# Altium project 003-00004.PrjPcb (part 1 of 2)
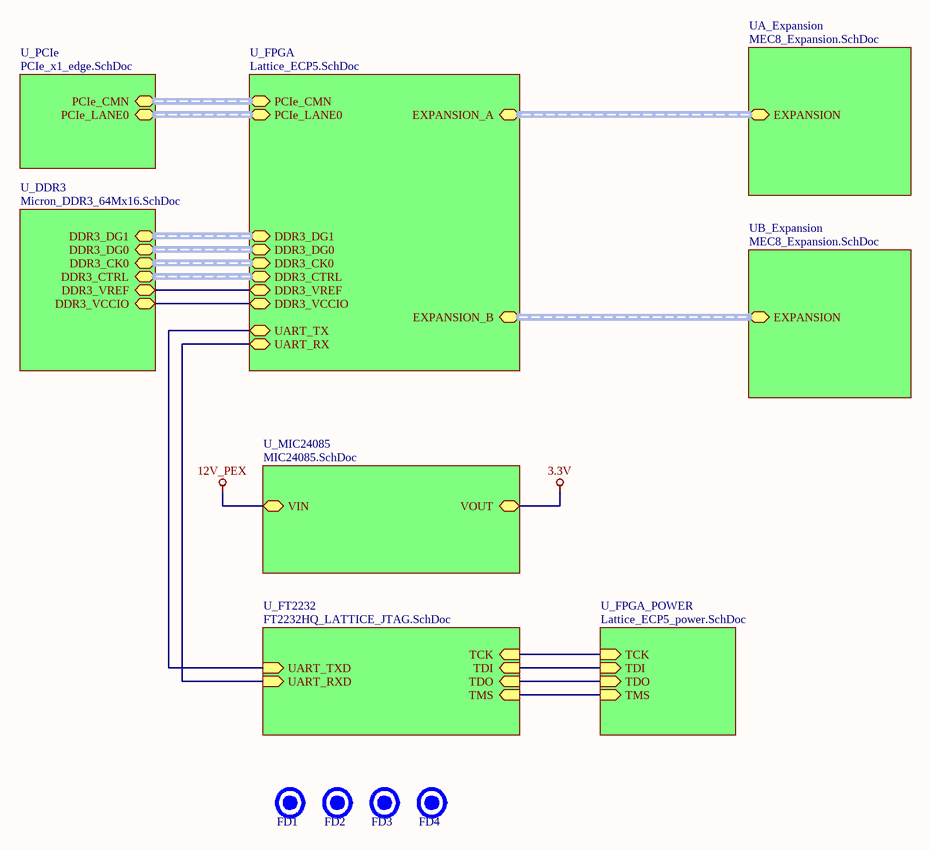
[diagram p0: 003-00004.SchDoc]
copyrightDate: 2014; DrillDrawingRevision: B; PCBPartNumber: 003-00004
8 sheets, 215 parts. Net scope: hierarchical (ports join the sheet entries above them; power ports are global).
Board file: 003-00004.PcbDoc
Sheets:
  003-00004.SchDoc
    U_FPGA = Lattice_ECP5.SchDoc
    U_FPGA_POWER = Lattice_ECP5_power.SchDoc
    UA_Expansion = MEC8_Expansion.SchDoc
    U_PCIe = PCIe_x1_edge.SchDoc
    UB_Expansion = MEC8_Expansion.SchDoc
    U_MIC24085 = MIC24085.SchDoc
    U_FT2232 = FT2232HQ_LATTICE_JTAG.SchDoc
    U_DDR3 = Micron_DDR3_64Mx16.SchDoc

## Sheet 003-00004.SchDoc: <title>
size C; Organization: Custom Embedded Solutions, LLC.; Address1: 130 Oakland Trace; Address2: Madison, AL 35758; DocumentNumber: <doc_num>; Revision: <Rev>; SheetNumber: 1; SheetTotal: 8; PageTitle: Block Diagram

### Parts
FD1  (no value)  [005-00024]  (no BOM)
FD2  (no value)  [005-00024]  (no BOM)
FD3  (no value)  [005-00024]  (no BOM)
FD4  (no value)  [005-00024]  (no BOM)

### Sub-sheets
U_DDR3 = Micron_DDR3_64Mx16.SchDoc: DDR3_DG1 (harness DDR3_DATAGRP), DDR3_DG0 (harness DDR3_DATAGRP), DDR3_CK0 (harness DDR3_CLK), DDR3_CTRL (harness DDR3_CTRL), DDR3_VREF, DDR3_VCCIO
U_FPGA = Lattice_ECP5.SchDoc: PCIe_CMN (harness PCIe_COMMON), PCIe_LANE0 (harness PCIe_LANE), EXPANSION_A (harness GPIO_EXPANSION), EXPANSION_B (harness GPIO_EXPANSION), DDR3_DG1 (harness DDR3_DATAGRP), DDR3_DG0 (harness DDR3_DATAGRP), DDR3_CK0 (harness DDR3_CLK), DDR3_CTRL (harness DDR3_CTRL), DDR3_VREF, DDR3_VCCIO, UART_TX, UART_RX
U_FPGA_POWER = Lattice_ECP5_power.SchDoc: TCK (in), TDI (in), TDO (in), TMS (in)
U_FT2232 = FT2232HQ_LATTICE_JTAG.SchDoc: TCK (in), TDI (in), TDO (in), TMS (in), UART_TXD (in), UART_RXD (in)
U_MIC24085 = MIC24085.SchDoc: VIN, VOUT
U_PCIe = PCIe_x1_edge.SchDoc: PCIe_CMN (harness PCIe_COMMON), PCIe_LANE0 (harness PCIe_LANE)
UA_Expansion = MEC8_Expansion.SchDoc: EXPANSION (harness GPIO_EXPANSION)
UB_Expansion = MEC8_Expansion.SchDoc: EXPANSION (harness GPIO_EXPANSION)

### Nets
DDR3_VCC: sheet U_FPGA/DDR3_VCCIO, sheet U_DDR3/DDR3_VCCIO
DDR3_VREF: sheet U_FPGA/DDR3_VREF, sheet U_DDR3/DDR3_VREF
JTAG_TCK: sheet U_FPGA_POWER/TCK, sheet U_FT2232/TCK
JTAG_TDI: sheet U_FPGA_POWER/TDI, sheet U_FT2232/TDI
JTAG_TDO: sheet U_FPGA_POWER/TDO, sheet U_FT2232/TDO
JTAG_TMS: sheet U_FPGA_POWER/TMS, sheet U_FT2232/TMS
TOP8: sheet U_FPGA/UART_TX, sheet U_FT2232/UART_TXD
TOP18: sheet U_FPGA/UART_RX, sheet U_FT2232/UART_RXD

### Buses and harness runs
harness sheet U_DDR3/DDR3_CK0 = sheet U_FPGA/DDR3_CK0
harness sheet U_DDR3/DDR3_CTRL = sheet U_FPGA/DDR3_CTRL
harness sheet U_DDR3/DDR3_DG0 = sheet U_FPGA/DDR3_DG0
harness sheet U_DDR3/DDR3_DG1 = sheet U_FPGA/DDR3_DG1
harness sheet U_FPGA/EXPANSION_A = sheet UA_Expansion/EXPANSION
harness sheet U_FPGA/EXPANSION_B = sheet UB_Expansion/EXPANSION
harness sheet U_FPGA/PCIe_CMN = sheet U_PCIe/PCIe_CMN
harness sheet U_FPGA/PCIe_LANE0 = sheet U_PCIe/PCIe_LANE0

### Notes on the sheet
- Copyright (c)
- Page Title
- Design Title
- Creative Commons License, http://creativecommons.org/licenses/by/4.0/legalcode
  This PCB design by Custom Embedded Solutions, LLC. is licensed under a Creative Commons Attribution 4.0 International License.
- Size:
- Date:
- File:
- C
- Document Number:
- Time:
- Sheet
- Rev:
- of

### Library data of the parts
FD1-FD4 = 008-00008: PCB fiducial, IPC-7351; Part Number: 008-00008; Package: Edge Connector, MEC8-30

## Sheet Lattice_ECP5.SchDoc: <title>
size C; Organization: Custom Embedded Solutions, LLC.; Address1: 130 Oakland Trace; Address2: Madison, AL 35758; DocumentNumber: <doc_num>; Revision: <Rev>; SheetNumber: 2; SheetTotal: 8; PageTitle: FPGA I/O
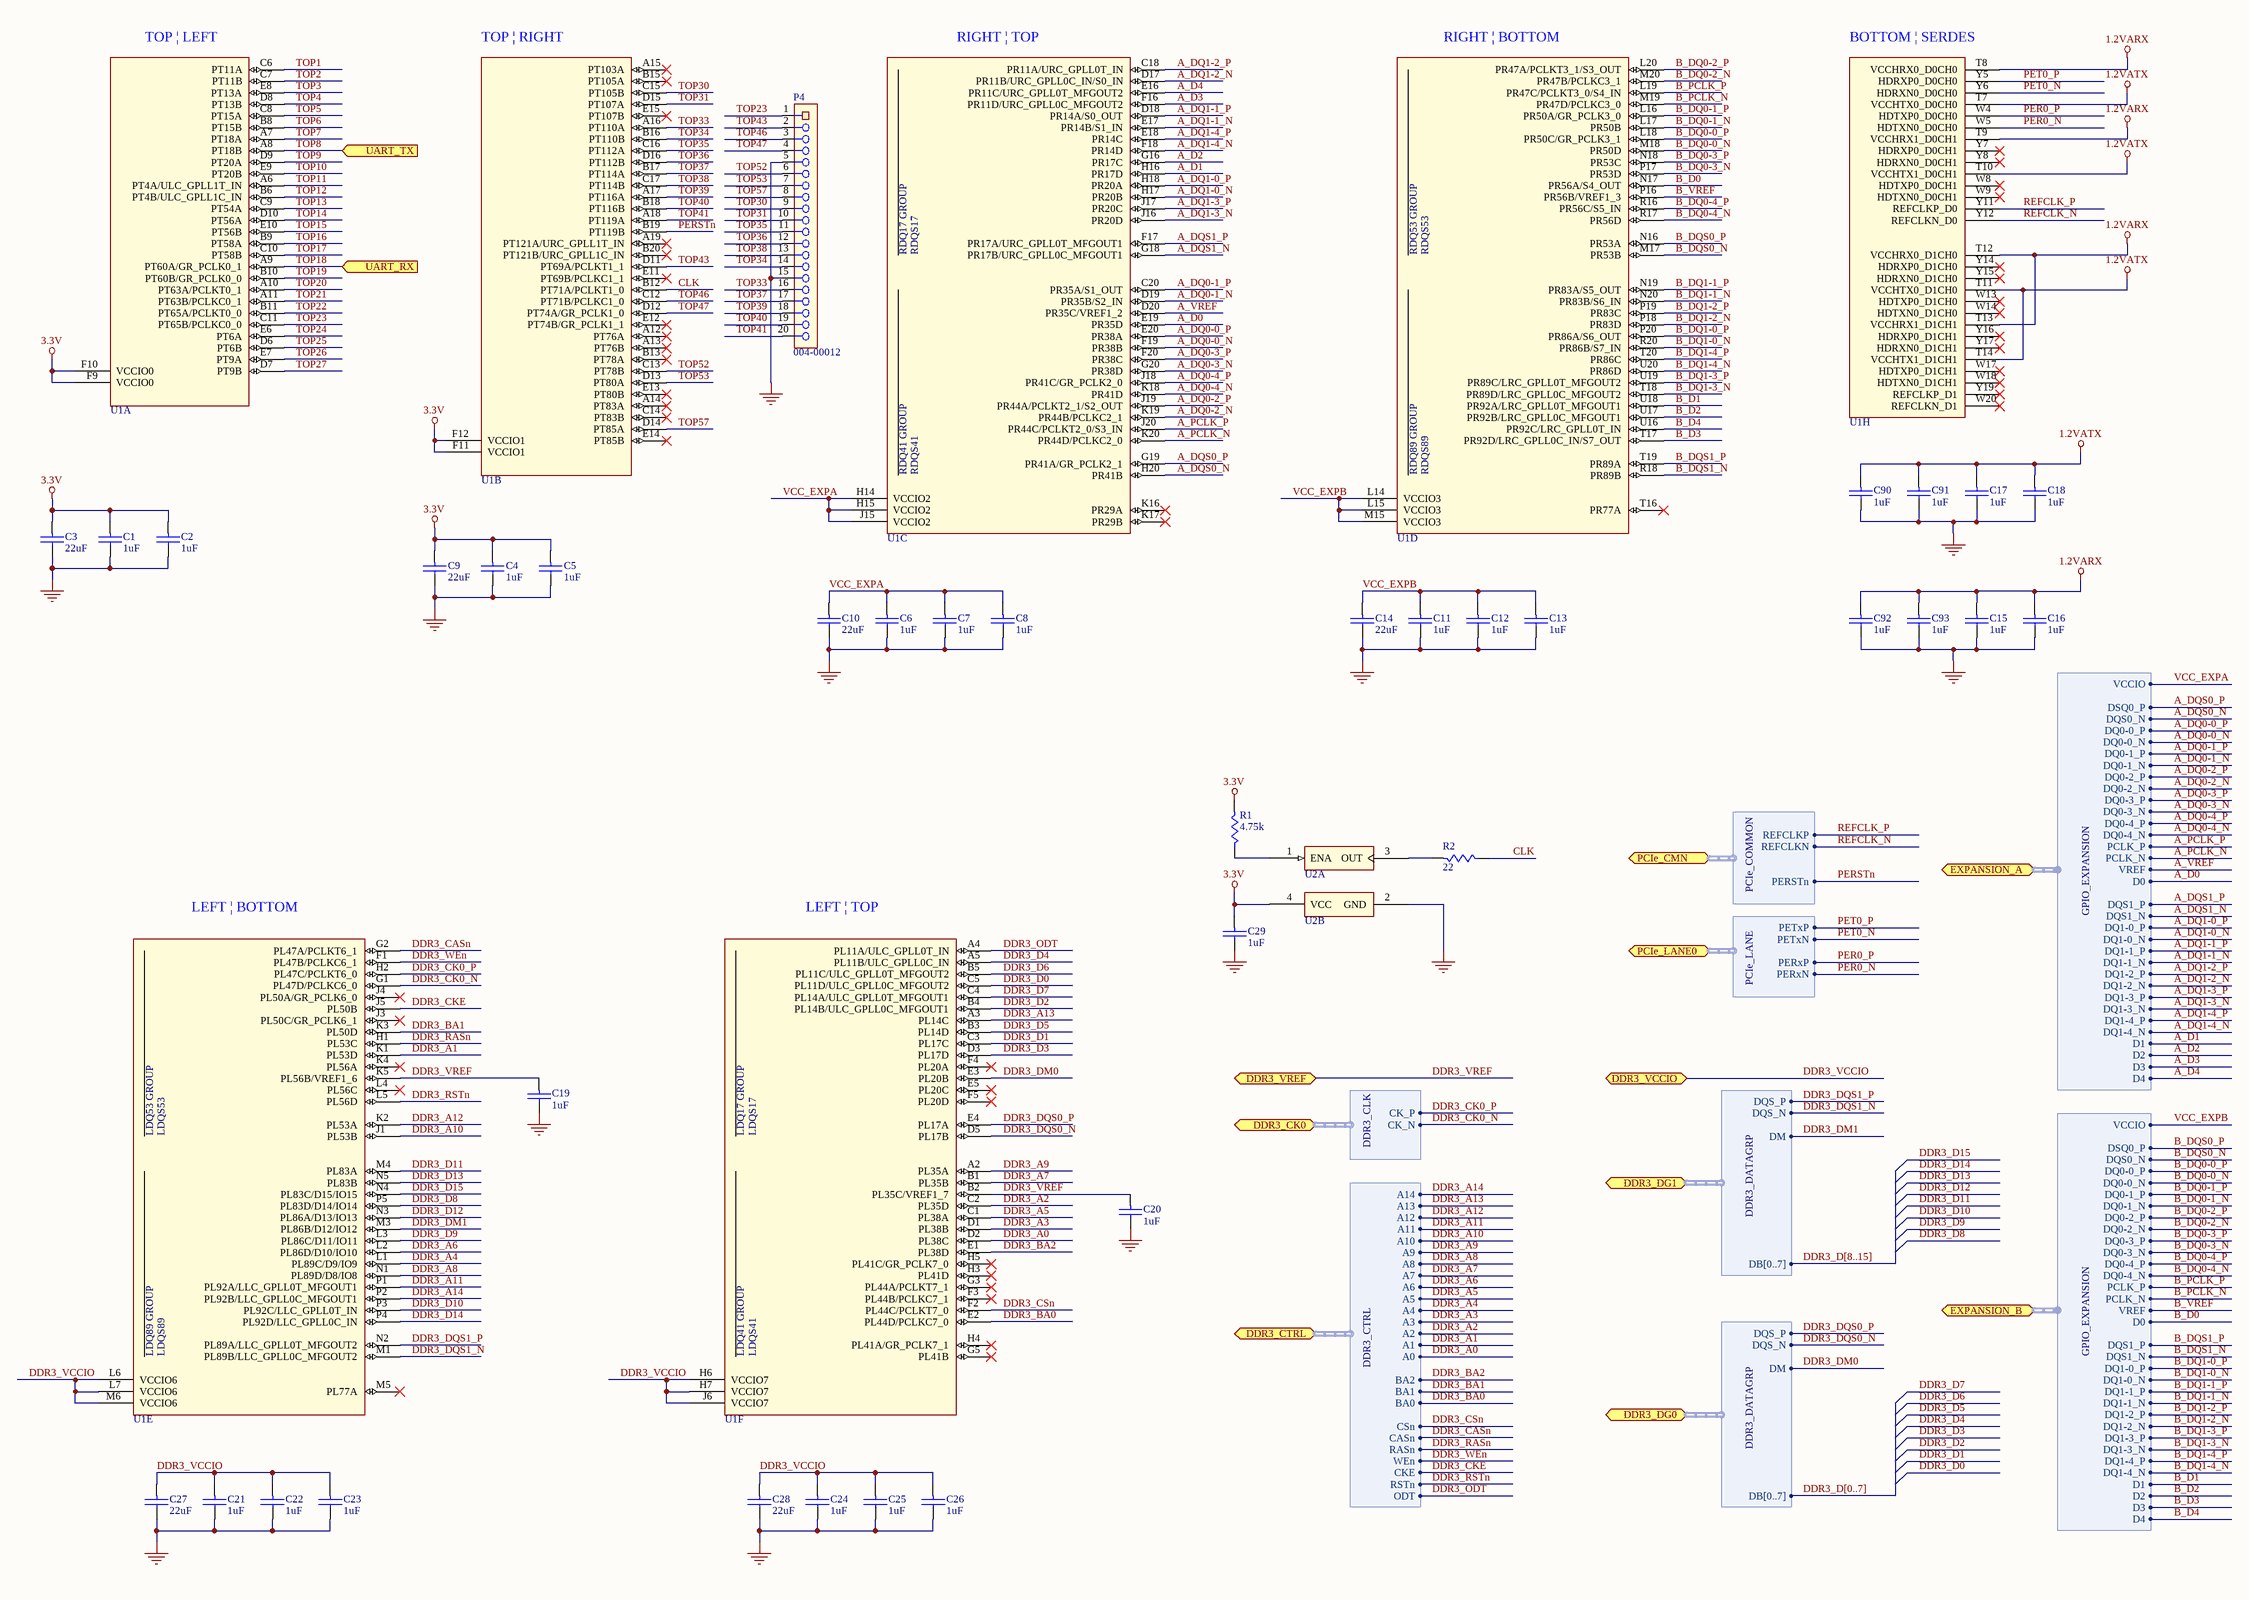
[diagram p1: Lattice_ECP5.SchDoc]

### Parts
(Parts that share a designator on the sheet are numbered #1, #2 ... from top to bottom, then left to right.)
C1#1  1uF  [005-00008]
C2#1  1uF  [005-00008]
C3#1  22uF  [005-00003]
C4#1  1uF  [005-00008]
C5#1  1uF  [005-00008]
C6#1  1uF  [005-00008]
C7#1  1uF  [005-00008]
C8#1  1uF  [005-00008]
C9#1  22uF  [005-00003]
C10#1  22uF  [005-00003]
C11  1uF  [005-00008]
C12  1uF  [005-00008]
C13  1uF  [005-00008]
C14  22uF  [005-00003]
C15  1uF  [005-00008]
C16  1uF  [005-00008]
C17  1uF  [005-00008]
C18  1uF  [005-00008]
C19  1uF  [005-00008]
C20  1uF  [005-00008]
C21  1uF  [005-00008]
C22  1uF  [005-00008]
C23  1uF  [005-00008]
C24  1uF  [005-00008]
C25  1uF  [005-00008]
C26  1uF  [005-00008]
C27  22uF  [005-00003]
C28  22uF  [005-00003]
C29  1uF  [005-00008]
C90  1uF  [005-00008]
C91  1uF  [005-00008]
C92  1uF  [005-00008]
C93  1uF  [005-00008]
P4  004-00012  [005-00014]
R1  4.75k  [005-00009]
R2#1  22  [005-00009]
U1#1  004-00015  [005-00017]  (value not drawn)  (parts A,B,C,D,E,F,H of 10)
U2#1  004-00014  [005-00016]  (value not drawn)  (parts A,B of 2)

### Ports
DDR3_CK0 (harness DDR3_CLK), DDR3_CTRL (harness DDR3_CTRL), DDR3_DG0 (harness DDR3_DATAGRP), DDR3_DG1 (harness DDR3_DATAGRP), DDR3_VCCIO, DDR3_VREF, EXPANSION_A (harness GPIO_EXPANSION), EXPANSION_B (harness GPIO_EXPANSION), PCIe_CMN (harness PCIe_COMMON), PCIe_LANE0 (harness PCIe_LANE), UART_RX (in), UART_TX (in)

### Harnesses
PCIe_COMMON: PERSTn, REFCLKP, REFCLKN
PCIe_LANE: PETxP, PETxN, PERxP, PERxN
GPIO_EXPANSION: DSQ0_P, DQS0_N, DQ0-0_P, DQ0-0_N, DQ0-1_P, DQ0-1_N, DQ0-2_P, DQ0-2_N, DQ0-3_P, DQ0-3_N, DQ0-4_P, DQ0-4_N, PCLK_P, PCLK_N, VREF, D0, DQS1_P, DQS1_N, DQ1-0_P, DQ1-0_N, DQ1-1_P, DQ1-1_N, DQ1-2_P, DQ1-2_N, DQ1-3_P, DQ1-3_N, DQ1-4_P, DQ1-4_N, D1, D2, D3, D4, VCCIO
DDR3_CLK: CK_P, CK_N
DDR3_CTRL: A14, A13, A12, A11, A10, A9, A8, A7, A6, A5, A4, A3, A2, A1, A0, BA2, BA1, BA0, CSn, RASn, CASn, WEn, CKE, RSTn, ODT
DDR3_DATAGRP: DQS_P, DQS_N, DM, DB[0..7]

### Nets
1.2VARX: C15.1 C16.1 C92.1 C93.1 U1#1.T8(VCCHRX0_D0CH0) U1#1.T9(VCCHRX1_D0CH1) U1#1.T12(VCCHRX0_D1CH0) U1#1.T13(VCCHRX1_D1CH1)
1.2VATX: C17.1 C18.1 C90.1 C91.1 U1#1.T7(VCCHTX0_D0CH0) U1#1.T10(VCCHTX1_D0CH1) U1#1.T11(VCCHTX0_D1CH0) U1#1.T14(VCCHTX1_D1CH1)
3.3V: C1#1.1 C2#1.1 C3#1.1 C4#1.1 C5#1.1 C9#1.1 C29.1 R1.1 U1#1.F9(VCCIO0) U1#1.F10(VCCIO0) U1#1.F11(VCCIO1) U1#1.F12(VCCIO1) U2#1.4(VCC)
GND: C1#1.2 C2#1.2 C3#1.2 C4#1.2 C5#1.2 C6#1.2 C7#1.2 C8#1.2 C9#1.2 C10#1.2 C11.2 C12.2 C13.2 C14.2 C15.2 C16.2 C17.2 C18.2 C19.2 C20.2 C21.2 C22.2 C23.2 C24.2 C25.2 C26.2 C27.2 C28.2 C29.2 C90.2 C91.2 C92.2 C93.2 P4.5 P4.15 U2#1.2(GND)
A_D0: U1#1.E19(PR35D) ; port EXPANSION_A.D0
A_D1: U1#1.H16(PR17D) ; port EXPANSION_A.D1
A_D2: U1#1.G16(PR17C) ; port EXPANSION_A.D2
A_D3: U1#1.F16(PR11D/URC_GPLL0C_MFGOUT2) ; port EXPANSION_A.D3
A_D4: U1#1.E16(PR11C/URC_GPLL0T_MFGOUT2) ; port EXPANSION_A.D4
A_DQ0-0_N: U1#1.F19(PR38B) ; port EXPANSION_A.DQ0-0_N
A_DQ0-0_P: U1#1.E20(PR38A) ; port EXPANSION_A.DQ0-0_P
A_DQ0-1_N: U1#1.D19(PR35B/S2_IN) ; port EXPANSION_A.DQ0-1_N
A_DQ0-1_P: U1#1.C20(PR35A/S1_OUT) ; port EXPANSION_A.DQ0-1_P
A_DQ0-2_N: U1#1.K19(PR44B/PCLKC2_1) ; port EXPANSION_A.DQ0-2_N
A_DQ0-2_P: U1#1.J19(PR44A/PCLKT2_1/S2_OUT) ; port EXPANSION_A.DQ0-2_P
A_DQ0-3_N: U1#1.G20(PR38D) ; port EXPANSION_A.DQ0-3_N
A_DQ0-3_P: U1#1.F20(PR38C) ; port EXPANSION_A.DQ0-3_P
A_DQ0-4_N: U1#1.K18(PR41D) ; port EXPANSION_A.DQ0-4_N
A_DQ0-4_P: U1#1.J18(PR41C/GR_PCLK2_0) ; port EXPANSION_A.DQ0-4_P
A_DQ1-0_N: U1#1.H17(PR20B) ; port EXPANSION_A.DQ1-0_N
A_DQ1-0_P: U1#1.H18(PR20A) ; port EXPANSION_A.DQ1-0_P
A_DQ1-1_N: U1#1.E17(PR14B/S1_IN) ; port EXPANSION_A.DQ1-1_N
A_DQ1-1_P: U1#1.D18(PR14A/S0_OUT) ; port EXPANSION_A.DQ1-1_P
A_DQ1-2_N: U1#1.D17(PR11B/URC_GPLL0C_IN/S0_IN) ; port EXPANSION_A.DQ1-2_N
A_DQ1-2_P: U1#1.C18(PR11A/URC_GPLL0T_IN) ; port EXPANSION_A.DQ1-2_P
A_DQ1-3_N: U1#1.J16(PR20D) ; port EXPANSION_A.DQ1-3_N
A_DQ1-3_P: U1#1.J17(PR20C) ; port EXPANSION_A.DQ1-3_P
A_DQ1-4_N: U1#1.F18(PR14D) ; port EXPANSION_A.DQ1-4_N
A_DQ1-4_P: U1#1.E18(PR14C) ; port EXPANSION_A.DQ1-4_P
A_DQS0_N: U1#1.H20(PR41B) ; port EXPANSION_A.DQS0_N
A_DQS0_P: U1#1.G19(PR41A/GR_PCLK2_1) ; port EXPANSION_A.DSQ0_P
A_DQS1_N: U1#1.G18(PR17B/URC_GPLL0C_MFGOUT1) ; port EXPANSION_A.DQS1_N
A_DQS1_P: U1#1.F17(PR17A/URC_GPLL0T_MFGOUT1) ; port EXPANSION_A.DQS1_P
A_PCLK_N: U1#1.K20(PR44D/PCLKC2_0) ; port EXPANSION_A.PCLK_N
A_PCLK_P: U1#1.J20(PR44C/PCLKT2_0/S3_IN) ; port EXPANSION_A.PCLK_P
A_VREF: U1#1.D20(PR35C/VREF1_2) ; port EXPANSION_A.VREF
B_D0: U1#1.N17(PR56A/S4_OUT) ; port EXPANSION_B.D0
B_D1: U1#1.U18(PR92A/LRC_GPLL0T_MFGOUT1) ; port EXPANSION_B.D1
B_D2: U1#1.U17(PR92B/LRC_GPLL0C_MFGOUT1) ; port EXPANSION_B.D2
B_D3: U1#1.T17(PR92D/LRC_GPLL0C_IN/S7_OUT) ; port EXPANSION_B.D3
B_D4: U1#1.U16(PR92C/LRC_GPLL0T_IN) ; port EXPANSION_B.D4
B_DQ0-0_N: U1#1.M18(PR50D) ; port EXPANSION_B.DQ0-0_N
B_DQ0-0_P: U1#1.L18(PR50C/GR_PCLK3_1) ; port EXPANSION_B.DQ0-0_P
B_DQ0-1_N: U1#1.L17(PR50B) ; port EXPANSION_B.DQ0-1_N
B_DQ0-1_P: U1#1.L16(PR50A/GR_PCLK3_0) ; port EXPANSION_B.DQ0-1_P
B_DQ0-2_N: U1#1.M20(PR47B/PCLKC3_1) ; port EXPANSION_B.DQ0-2_N
B_DQ0-2_P: U1#1.L20(PR47A/PCLKT3_1/S3_OUT) ; port EXPANSION_B.DQ0-2_P
B_DQ0-3_N: U1#1.P17(PR53D) ; port EXPANSION_B.DQ0-3_N
B_DQ0-3_P: U1#1.N18(PR53C) ; port EXPANSION_B.DQ0-3_P
B_DQ0-4_N: U1#1.R17(PR56D) ; port EXPANSION_B.DQ0-4_N
B_DQ0-4_P: U1#1.R16(PR56C/S5_IN) ; port EXPANSION_B.DQ0-4_P
B_DQ1-0_N: U1#1.R20(PR86B/S7_IN) ; port EXPANSION_B.DQ1-0_N
B_DQ1-0_P: U1#1.P20(PR86A/S6_OUT) ; port EXPANSION_B.DQ1-0_P
B_DQ1-1_N: U1#1.N20(PR83B/S6_IN) ; port EXPANSION_B.DQ1-1_N
B_DQ1-1_P: U1#1.N19(PR83A/S5_OUT) ; port EXPANSION_B.DQ1-1_P
B_DQ1-2_N: U1#1.P18(PR83D) ; port EXPANSION_B.DQ1-2_N
B_DQ1-2_P: U1#1.P19(PR83C) ; port EXPANSION_B.DQ1-2_P
B_DQ1-3_N: U1#1.T18(PR89D/LRC_GPLL0C_MFGOUT2) ; port EXPANSION_B.DQ1-3_N
B_DQ1-3_P: U1#1.U19(PR89C/LRC_GPLL0T_MFGOUT2) ; port EXPANSION_B.DQ1-3_P
B_DQ1-4_N: U1#1.U20(PR86D) ; port EXPANSION_B.DQ1-4_N
B_DQ1-4_P: U1#1.T20(PR86C) ; port EXPANSION_B.DQ1-4_P
B_DQS0_N: U1#1.M17(PR53B) ; port EXPANSION_B.DQS0_N
B_DQS0_P: U1#1.N16(PR53A) ; port EXPANSION_B.DSQ0_P
B_DQS1_N: U1#1.R18(PR89B) ; port EXPANSION_B.DQS1_N
B_DQS1_P: U1#1.T19(PR89A) ; port EXPANSION_B.DQS1_P
B_PCLK_N: U1#1.M19(PR47D/PCLKC3_0) ; port EXPANSION_B.PCLK_N
B_PCLK_P: U1#1.L19(PR47C/PCLKT3_0/S4_IN) ; port EXPANSION_B.PCLK_P
B_VREF: U1#1.P16(PR56B/VREF1_3) ; port EXPANSION_B.VREF
CLK: R2#1.2 U1#1.B12(PT71A/PCLKT1_0)
DDR3_A0: U1#1.D2(PL38C) ; port DDR3_CTRL.A0
DDR3_A1: U1#1.K1(PL53D) ; port DDR3_CTRL.A1
DDR3_A2: U1#1.C2(PL35D) ; port DDR3_CTRL.A2
DDR3_A3: U1#1.D1(PL38B) ; port DDR3_CTRL.A3
DDR3_A4: U1#1.L1(PL89C/D9/IO9) ; port DDR3_CTRL.A4
DDR3_A5: U1#1.C1(PL38A) ; port DDR3_CTRL.A5
DDR3_A6: U1#1.L2(PL86D/D10/IO10) ; port DDR3_CTRL.A6
DDR3_A7: U1#1.B1(PL35B) ; port DDR3_CTRL.A7
DDR3_A8: U1#1.N1(PL89D/D8/IO8) ; port DDR3_CTRL.A8
DDR3_A9: U1#1.A2(PL35A) ; port DDR3_CTRL.A9
DDR3_A10: U1#1.J1(PL53B) ; port DDR3_CTRL.A10
DDR3_A11: U1#1.P1(PL92A/LLC_GPLL0T_MFGOUT1) ; port DDR3_CTRL.A11
DDR3_A12: U1#1.K2(PL53A) ; port DDR3_CTRL.A12
DDR3_A13: U1#1.A3(PL14C) ; port DDR3_CTRL.A13
DDR3_A14: U1#1.P2(PL92B/LLC_GPLL0C_MFGOUT1) ; port DDR3_CTRL.A14
DDR3_BA0: U1#1.E2(PL44D/PCLKC7_0) ; port DDR3_CTRL.BA0
DDR3_BA1: U1#1.K3(PL50D) ; port DDR3_CTRL.BA1
DDR3_BA2: U1#1.E1(PL38D) ; port DDR3_CTRL.BA2
DDR3_CASn: U1#1.G2(PL47A/PCLKT6_1) ; port DDR3_CTRL.CASn
DDR3_CK0_N: U1#1.G1(PL47D/PCLKC6_0) ; port DDR3_CK0.CK_N
DDR3_CK0_P: U1#1.H2(PL47C/PCLKT6_0) ; port DDR3_CK0.CK_P
DDR3_CKE: U1#1.J5(PL50B) ; port DDR3_CTRL.CKE
DDR3_CSn: U1#1.F2(PL44C/PCLKT7_0) ; port DDR3_CTRL.CSn
DDR3_D0: U1#1.C5(PL11D/ULC_GPLL0C_MFGOUT2)
DDR3_D1: U1#1.C3(PL17C)
DDR3_D2: U1#1.B4(PL14B/ULC_GPLL0C_MFGOUT1)
DDR3_D3: U1#1.D3(PL17D)
DDR3_D4: U1#1.A5(PL11B/ULC_GPLL0C_IN)
DDR3_D5: U1#1.B3(PL14D)
DDR3_D6: U1#1.B5(PL11C/ULC_GPLL0T_MFGOUT2)
DDR3_D7: U1#1.C4(PL14A/ULC_GPLL0T_MFGOUT1)
DDR3_D8: U1#1.P5(PL83D/D14/IO14)
DDR3_D9: U1#1.L3(PL86C/D11/IO11)
DDR3_D10: U1#1.P3(PL92C/LLC_GPLL0T_IN)
DDR3_D11: U1#1.M4(PL83A)
DDR3_D12: U1#1.N3(PL86A/D13/IO13)
DDR3_D13: U1#1.N5(PL83B)
DDR3_D14: U1#1.P4(PL92D/LLC_GPLL0C_IN)
DDR3_D15: U1#1.N4(PL83C/D15/IO15)
DDR3_DM0: U1#1.E3(PL20B) ; port DDR3_DG0.DM
DDR3_DM1: U1#1.M3(PL86B/D12/IO12) ; port DDR3_DG1.DM
DDR3_DQS0_N: U1#1.D5(PL17B) ; port DDR3_DG0.DQS_N
DDR3_DQS0_P: U1#1.E4(PL17A) ; port DDR3_DG0.DQS_P
DDR3_DQS1_N: U1#1.M1(PL89B/LLC_GPLL0C_MFGOUT2) ; port DDR3_DG1.DQS_N
DDR3_DQS1_P: U1#1.N2(PL89A/LLC_GPLL0T_MFGOUT2) ; port DDR3_DG1.DQS_P
DDR3_ODT: U1#1.A4(PL11A/ULC_GPLL0T_IN) ; port DDR3_CTRL.ODT
DDR3_RASn: U1#1.H1(PL53C) ; port DDR3_CTRL.RASn
DDR3_RSTn: U1#1.L5(PL56D) ; port DDR3_CTRL.RSTn
DDR3_VCCIO: C21.1 C22.1 C23.1 C24.1 C25.1 C26.1 C27.1 C28.1 U1#1.H6(VCCIO7) U1#1.H7(VCCIO7) U1#1.J6(VCCIO7) U1#1.L6(VCCIO6) U1#1.L7(VCCIO6) U1#1.M6(VCCIO6) ; port DDR3_VCCIO  [project net DDR3_VCC]
DDR3_VREF: C19.1 C20.1 U1#1.B2(PL35C/VREF1_7) U1#1.K5(PL56B/VREF1_6) ; port DDR3_VREF
DDR3_WEn: U1#1.F1(PL47B/PCLKC6_1) ; port DDR3_CTRL.WEn
PER0_N: U1#1.W5(HDTXN0_D0CH0) ; port PCIe_LANE0.PERxN
PER0_P: U1#1.W4(HDTXP0_D0CH0) ; port PCIe_LANE0.PERxP
PERSTn: U1#1.B19(PT119B) ; port PCIe_CMN.PERSTn
PET0_N: U1#1.Y6(HDRXN0_D0CH0) ; port PCIe_LANE0.PETxN
PET0_P: U1#1.Y5(HDRXP0_D0CH0) ; port PCIe_LANE0.PETxP
REFCLK_N: U1#1.Y12(REFCLKN_D0) ; port PCIe_CMN.REFCLKN
REFCLK_P: U1#1.Y11(REFCLKP_D0) ; port PCIe_CMN.REFCLKP
TOP1: U1#1.C6(PT11A)
TOP2: U1#1.C7(PT11B)
TOP3: U1#1.E8(PT13A)
TOP4: U1#1.D8(PT13B)
TOP5: U1#1.C8(PT15A)
TOP6: U1#1.B8(PT15B)
TOP7: U1#1.A7(PT18A)
TOP8: U1#1.A8(PT18B) ; port UART_TX
TOP9: U1#1.D9(PT20A)
TOP10: U1#1.E9(PT20B)
TOP11: U1#1.A6(PT4A/ULC_GPLL1T_IN)
TOP12: U1#1.B6(PT4B/ULC_GPLL1C_IN)
TOP13: U1#1.C9(PT54A)
TOP14: U1#1.D10(PT56A)
TOP15: U1#1.E10(PT56B)
TOP16: U1#1.B9(PT58A)
TOP17: U1#1.C10(PT58B)
TOP18: U1#1.A9(PT60A/GR_PCLK0_1) ; port UART_RX
TOP19: U1#1.B10(PT60B/GR_PCLK0_0)
TOP20: U1#1.A10(PT63A/PCLKT0_1)
TOP21: U1#1.A11(PT63B/PCLKC0_1)
TOP22: U1#1.B11(PT65A/PCLKT0_0)
TOP23: P4.1 U1#1.C11(PT65B/PCLKC0_0)
TOP24: U1#1.E6(PT6A)
TOP25: U1#1.D6(PT6B)
TOP26: U1#1.E7(PT9A)
TOP27: U1#1.D7(PT9B)
TOP30: P4.9 U1#1.C15(PT105B)
TOP31: P4.10 U1#1.D15(PT107A)
TOP33: P4.16 U1#1.A16(PT110A)
TOP34: P4.14 U1#1.B16(PT110B)
TOP35: P4.11 U1#1.C16(PT112A)
TOP36: P4.12 U1#1.D16(PT112B)
TOP37: P4.17 U1#1.B17(PT114A)
TOP38: P4.13 U1#1.C17(PT114B)
TOP39: P4.18 U1#1.A17(PT116A)
TOP40: P4.19 U1#1.B18(PT116B)
TOP41: P4.20 U1#1.A18(PT119A)
TOP43: P4.2 U1#1.D11(PT69A/PCLKT1_1)
TOP46: P4.3 U1#1.C12(PT71B/PCLKC1_0)
TOP47: P4.4 U1#1.D12(PT74A/GR_PCLK1_0)
TOP52: P4.6 U1#1.C13(PT78B)
TOP53: P4.7 U1#1.D13(PT80A)
TOP57: P4.8 U1#1.D14(PT85A)
VCC_EXPA: C6#1.1 C7#1.1 C8#1.1 C10#1.1 U1#1.H14(VCCIO2) U1#1.H15(VCCIO2) U1#1.J15(VCCIO2) ; port EXPANSION_A.VCCIO
VCC_EXPB: C11.1 C12.1 C13.1 C14.1 U1#1.L14(VCCIO3) U1#1.L15(VCCIO3) U1#1.M15(VCCIO3) ; port EXPANSION_B.VCCIO
NetR1_2: R1.2 U2#1.1(ENA)
NetR2#1_1: R2#1.1 U2#1.3(OUT)

Not connected (* = marked no-connect by the designer): U1#1 A12(PT76A)* A13(PT76B)* A14(PT83A)* A15(PT103A)* A19(PT121A/URC_GPLL1T_IN)* B13(PT78A)* B15(PT105A)* B20(PT121B/URC_GPLL1C_IN)* C14(PT83B)* E5(PL20C)* E11(PT69B/PCLKC1_1)* E12(PT74B/GR_PCLK1_1)* E13(PT80B)* E14(PT85B)* E15(PT107B)* F3(PL44B/PCLKC7_1)* F4(PL20A)* F5(PL20D)* G3(PL44A/PCLKT7_1)* G5(PL41B)* H3(PL41D)* H4(PL41A/GR_PCLK7_1)* H5(PL41C/GR_PCLK7_0)* J3(PL50C/GR_PCLK6_1)* J4(PL50A/GR_PCLK6_0)* K4(PL56A)* K16(PR29A)* K17(PR29B)* L4(PL56C)* M5(PL77A)* T16(PR77A)* W8(HDTXP0_D0CH1)* W9(HDTXN0_D0CH1)* W13(HDTXP0_D1CH0)* W14(HDTXN0_D1CH0)* W17(HDTXP0_D1CH1)* W18(HDTXN0_D1CH1)* W20(REFCLKN_D1)* Y7(HDRXP0_D0CH1)* Y8(HDRXN0_D0CH1)* Y14(HDRXP0_D1CH0)* Y15(HDRXN0_D1CH0)* Y16(HDRXP0_D1CH1)* Y17(HDRXN0_D1CH1)* Y19(REFCLKP_D1)*

### Buses and harness runs
bus DDR3_D[0..7]
bus DDR3_D[8..15]

### Notes on the sheet
- (near U1#1) TOP | LEFT
- (near U1#1) TOP | RIGHT
- (near U1#1) RIGHT | TOP
- (near U1#1) RIGHT | BOTTOM
- (near U1#1) BOTTOM | SERDES
- (near U1#1) LEFT | BOTTOM
- (near U1#1) LEFT | TOP
- Copyright (c)
- Page Title
- Design Title
- Creative Commons License, http://creativecommons.org/licenses/by/4.0/legalcode
  This PCB design by Custom Embedded Solutions, LLC. is licensed under a Creative Commons Attribution 4.0 International License.
- Size:
- Date:
- File:
- C
- Document Number:
- Time:
- Sheet
- Rev:
- of
- (in symbol 012-00019, part C) RDQ17 GROUP; RDQS17; RDQ41 GROUP; RDQS41
- (in symbol 012-00019, part D) RDQ53 GROUP; RDQS53; RDQ89 GROUP; RDQS89
- (in symbol 012-00019, part E) LDQ53 GROUP; LDQS53; LDQ89 GROUP; LDQS89
- (in symbol 012-00019, part F) LDQ17 GROUP; LDQS17; LDQ41 GROUP; LDQS41

### Library data of the parts
C1#1 C2#1 C4#1 C5#1 C6#1 C7#1 C8#1 C11-C13 C15-C26 C90-C93 = 011-00017: CAP CER 1UF 6.3V 10% X5R 0402; Manufacturer1 Part Number: CL05A105KQ5NNNC; Manufacturer1: Samsung; Types: Y1; Type: Ceramic; Part Number: 011-00017; Substrate: X5R; Voltage: 6.3V; Value: 1uF; Package: 1005, EIA 0402, Chip Capacitor, 2-Leads, Body 1.00x0.50mm, IPC High Density
C3#1 C9#1 C10#1 C14 C27 C28 = 011-00004: CAP CER 22UF 6.3V X5R 20% 0805; Manufacturer1 Part Number: C2012X5R0J226M/1.25; Manufacturer1: TDK; Manufacturer2 Part Number: CL21A226KQQNNNF; Manufacturer3 Part Number: 08056D226MAT2A; 3rd Party: {Reference Design}; Type: Ceramic; Part Number: 011-00004; Voltage: 6.3V; Substrate: X5R; Manufacturer2: Samsung; Manufacturer3: AVX; Value: 22uF; Package: 2012, EIA 0805, Chip Capacitor, 2-Leads, Body 2.00x1.25mm, IPC High Density
C29 = 011-00010: Capacitor 1uF 10V Ceramic 10% 0402; Manufacturer1 Part Number: 0402ZD105KAT2A; Manufacturer1: AVX; 3rd Party: {Reference Design}; Types: Ratings; Part Number: 011-00010; Voltage: 10V; Type: Ceramic; Value: 1uF; Package: 1005, EIA 0402, Chip Capacitor, 2-Leads, Body 1.00x0.50mm, IPC High Density
P4 = 017-00011: CONN RCPT 2x10; Manufacturer1 Part Number: 54102-S05-10LF; Manufacturer1: FCI; Manufacturer2 Part Number: TSHS-110-D-06-A-GT-LF; Circuits: 20; Part Number: 017-00011; Manufacturer2: Major League; Manufacturer3: Molex; Manufacturer3 Part Number: 10-89-7202; Type: Receptacle; Package: 2x10 100mil header
R1 = 009-00001: RES 4.75K OHM 1/16W 1% 0402 SMD; Manufacturer1 Part Number: RMCF0402FT4K75; Manufacturer1: Stackpole Electronics; 3rd Party: {Reference Design}; Tolerance: 0.01; Types: Metal Film; Part Number: 009-00001; Power: 1/16W; Value: 4.75k; Package: 1005, EIA 0402, Chip Resistor, 2-Leads, Body 1.00x0.50mm, IPC High Density
R2#1 = 009-00020: RES 22 OHM 1/16W 5% 0402; Manufacturer1 Part Number: RMCF0402JT22R0; Manufacturer1: Stackpole Electronics; Tolerance: 0.05; Part Number: 009-00020; Power: 1/16W; Value: 22; Package: 1005, EIA 0402, Chip Resistor, 2-Leads, Body 1.00x0.50mm, IPC High Density
U1#1 = 012-00019: IC FPGA 4/203 I/O 381caBGA; Manufacturer1: Lattice; Manufacturer1 Part Number: LFE5UM-45F-6BG381C; SWAP_INFO: (S1+S2+S3+S4+S5+S6+S7+S8+S9+S10); SPLIT_INST: TRUE; Part Number: 012-00019; Type: Embedded (uP/PLD); Package: CABGA 381 8x14x1.2mm 17.0x17.0mm 0.8mm pitch
U2#1 = 015-00005: OSC MEMS 50.000 MHZ SMD; Manufacturer1 Part Number: ASEMB-50.000MHZ-LC-T; Manufacturer1: Abracon; Stability: 3.3V – 1.8V; Capacitance: 50ppm; Tolerance: Tri-state; Part Number: 015-00005; Value: 50.000MHz; Package: 3225, Osc, 4-Leads, Body 3.20x2.50mm

## Sheet Lattice_ECP5_power.SchDoc: <title>
size C; Organization: Custom Embedded Solutions, LLC.; Address1: 130 Oakland Trace; Address2: Madison, AL 35758; DocumentNumber: <doc_num>; Revision: <Rev>; SheetNumber: 3; SheetTotal: 8; PageTitle: FPGA Power
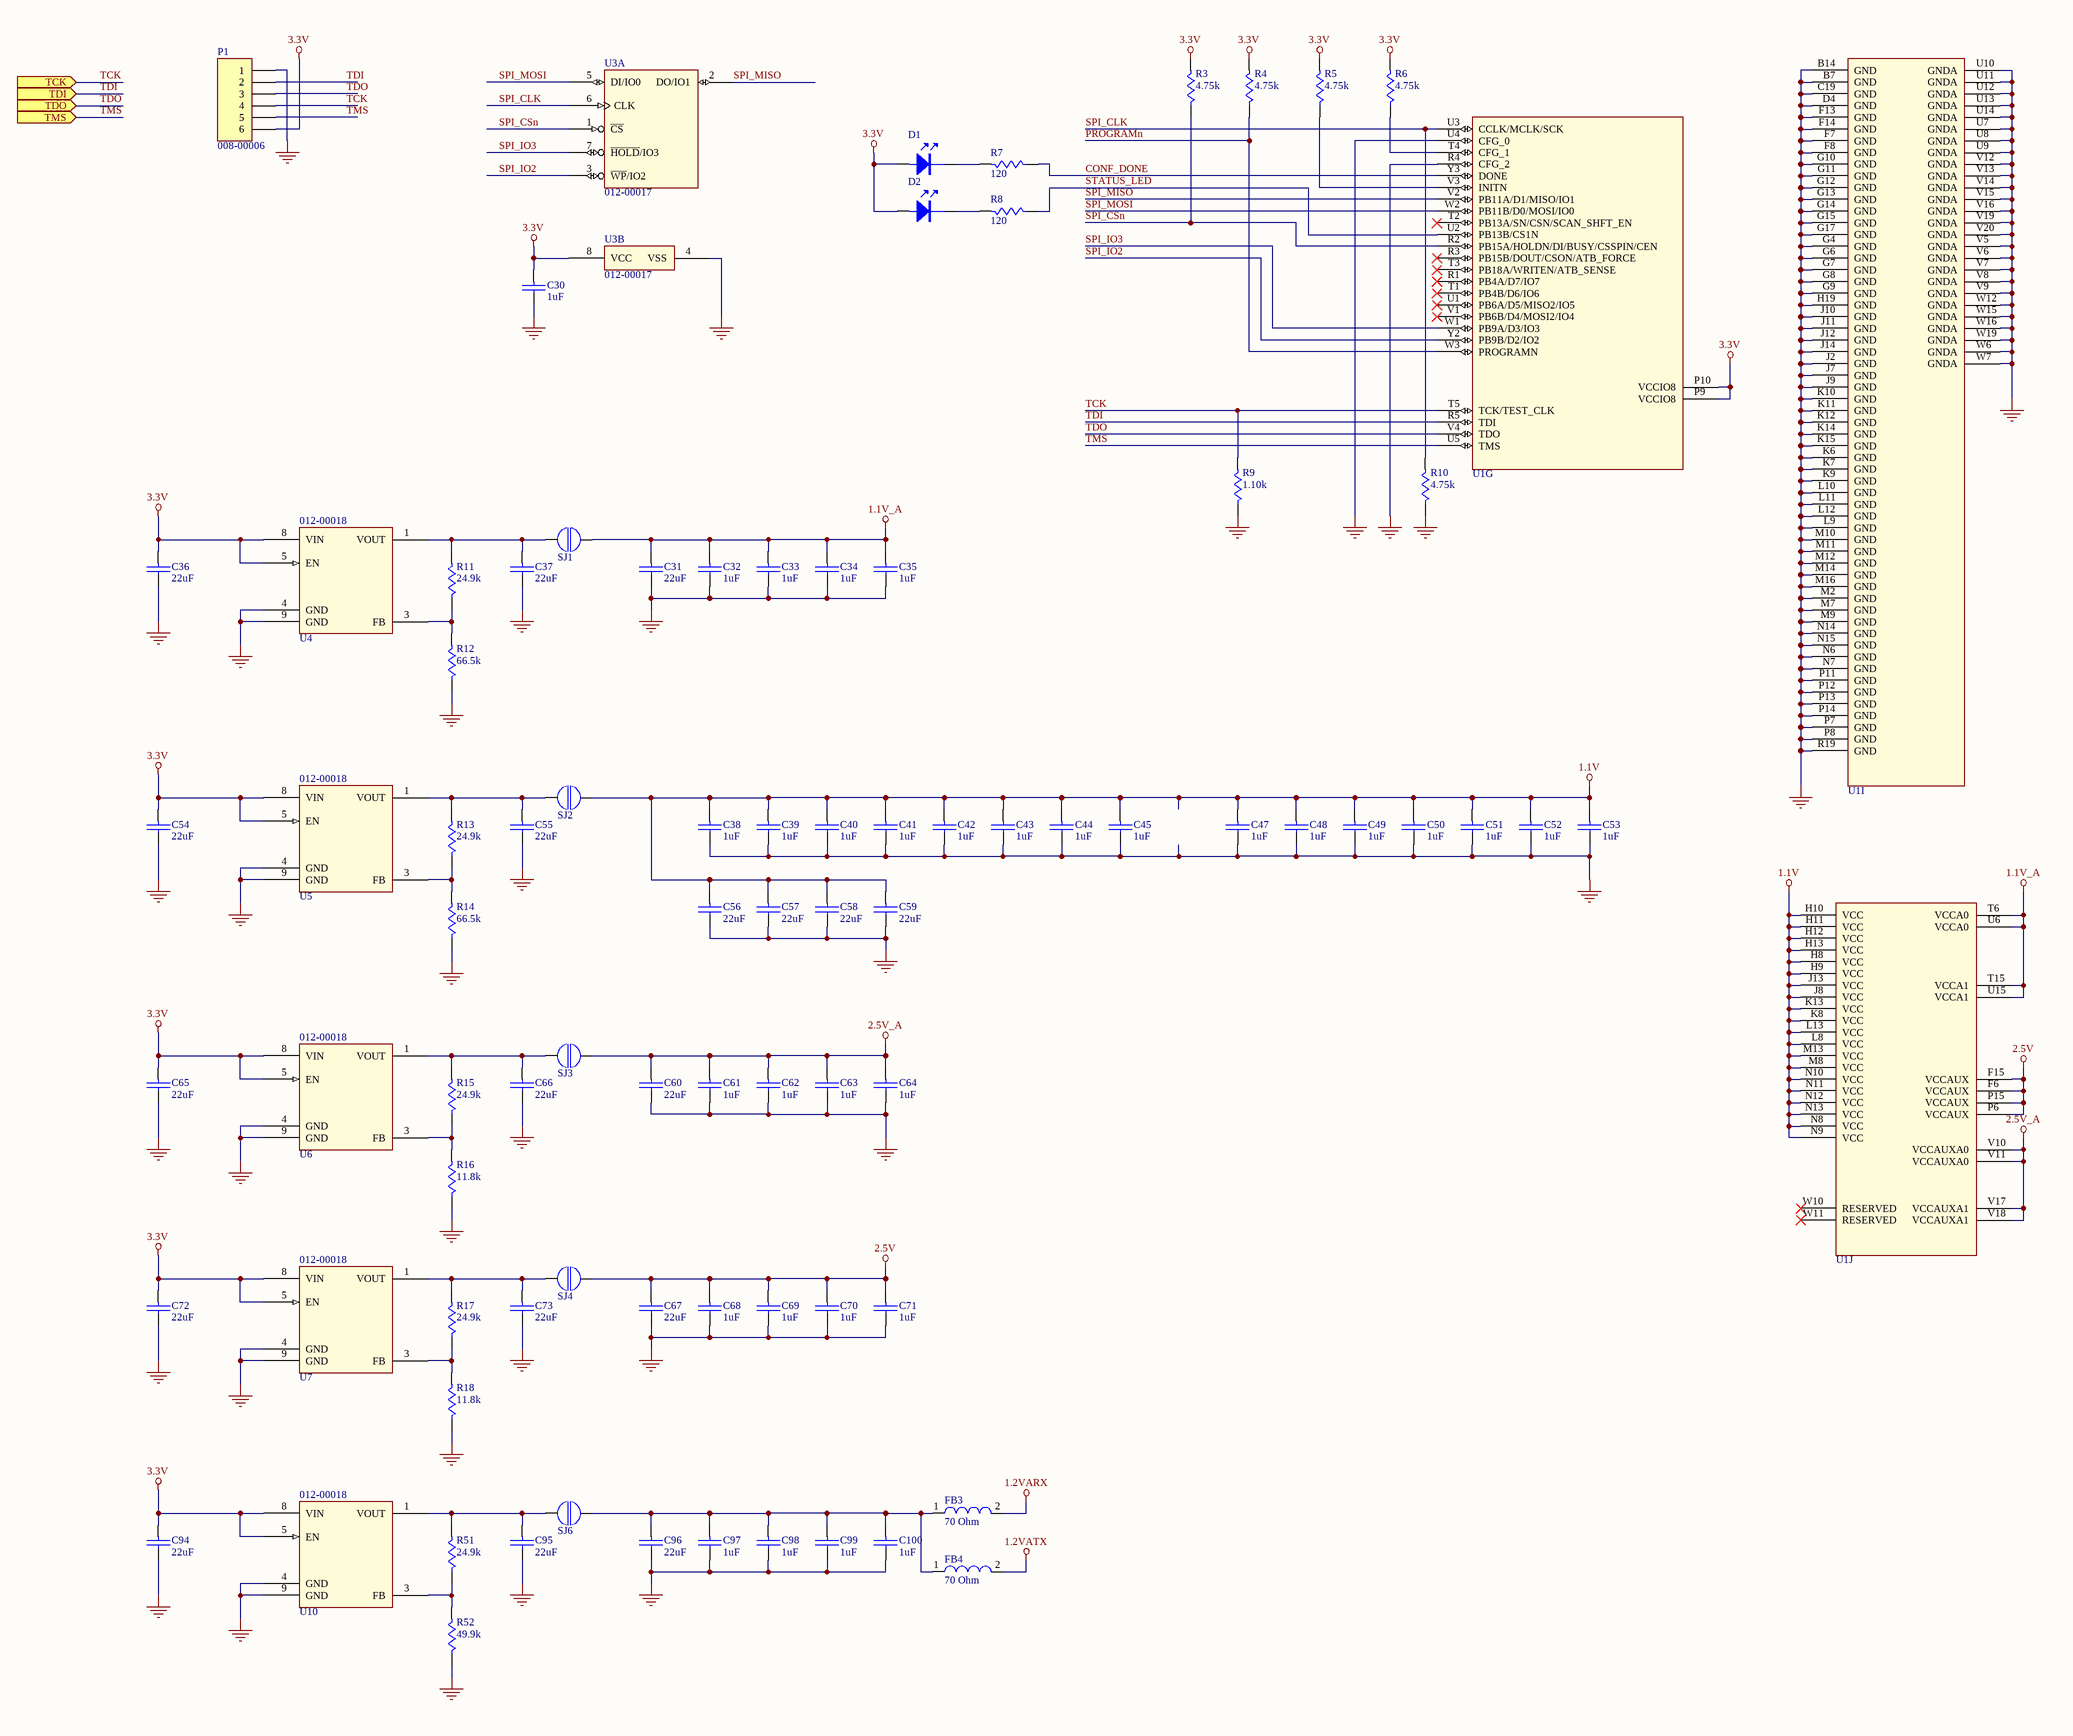
[diagram p2: Lattice_ECP5_power.SchDoc]

### Parts
(Parts that share a designator on the sheet are numbered #1, #2 ... from top to bottom, then left to right.)
C30  1uF  [005-00008]
C31  22uF  [005-00003]
C32  1uF  [005-00008]
C33  1uF  [005-00008]
C34  1uF  [005-00008]
C35  1uF  [005-00008]
C36  22uF  [005-00003]
C37  22uF  [005-00003]
C38  1uF  [005-00008]
C39  1uF  [005-00008]
C40  1uF  [005-00008]
C41  1uF  [005-00008]
C42  1uF  [005-00008]
C43  1uF  [005-00008]
C44  1uF  [005-00008]
C45  1uF  [005-00008]
C47  1uF  [005-00008]
C48  1uF  [005-00008]
C49  1uF  [005-00008]
C50  1uF  [005-00008]
C51  1uF  [005-00008]
C52  1uF  [005-00008]
C53  1uF  [005-00008]
C54  22uF  [005-00003]
C55  22uF  [005-00003]
C56  22uF  [005-00003]
C57  22uF  [005-00003]
C58  22uF  [005-00003]
C59  22uF  [005-00003]
C60  22uF  [005-00003]
C61  1uF  [005-00008]
C62  1uF  [005-00008]
C63  1uF  [005-00008]
C64  1uF  [005-00008]
C65  22uF  [005-00003]
C66  22uF  [005-00003]
C67  22uF  [005-00003]
C68  1uF  [005-00008]
C69  1uF  [005-00008]
C70  1uF  [005-00008]
C71  1uF  [005-00008]
C72  22uF  [005-00003]
C73  22uF  [005-00003]
C94  22uF  [005-00003]
C95  22uF  [005-00003]
C96  22uF  [005-00003]
C97  1uF  [005-00008]
C98  1uF  [005-00008]
C99  1uF  [005-00008]
C100  1uF  [005-00008]
D1#1  (no value)  [005-00018]
D2  (no value)  [005-00018]
FB3  70 Ohm  [005-00010]
FB4  70 Ohm  [005-00010]
P1  Part Number: 008-00006  [005-00023]
R3#1  4.75k  [005-00009]
R4#1  4.75k  [005-00009]
R5#1  4.75k  [005-00009]
R6#1  4.75k  [005-00009]
R7#1  120  [005-00009]
R8  120  [005-00009]
R9#1  1.10k  [005-00009]
R10  4.75k  [005-00009]
R11  24.9k  [005-00009]
R12  66.5k  [005-00009]
R13  24.9k  [005-00009]
R14  66.5k  [005-00009]
R15  24.9k  [005-00009]
R16  11.8k  [005-00009]
R17  24.9k  [005-00009]
R18  11.8k  [005-00009]
R51  24.9k  [005-00009]
R52  49.9k  [005-00009]
SJ1  004-00013  [005-00015]  (value not drawn)
SJ2  004-00013  [005-00015]  (value not drawn)
SJ3  004-00013  [005-00015]  (value not drawn)
SJ4  004-00013  [005-00015]  (value not drawn)
SJ6  004-00013  [005-00015]  (value not drawn)
U1#1  004-00015  [005-00017]  (value not drawn)  (parts G,I,J of 10)
U3#1  Part Number: 012-00017  [005-00022]  (hidden comment: 004-00020)  (parts A,B of 2)
U4  Part Number: 012-00018  [005-00011]  (hidden comment: AP7361-FGE-7)
U5  Part Number: 012-00018  [005-00011]  (hidden comment: AP7361-FGE-7)
U6  Part Number: 012-00018  [005-00011]  (hidden comment: AP7361-FGE-7)
U7  Part Number: 012-00018  [005-00011]  (hidden comment: AP7361-FGE-7)
U10  Part Number: 012-00018  [005-00011]  (hidden comment: AP7361-FGE-7)

### Ports
TCK (in), TDI (in), TDO (in), TMS (in)

### Nets
1.1V: C38.1 C39.1 C40.1 C41.1 C42.1 C43.1 C44.1 C45.1 C47.1 C48.1 C49.1 C50.1 C51.1 C52.1 C53.1 C56.1 C57.1 C58.1 C59.1 SJ2.2 U1#1.H8(VCC) U1#1.H9(VCC) U1#1.H10(VCC) U1#1.H11(VCC) U1#1.H12(VCC) U1#1.H13(VCC) U1#1.J8(VCC) U1#1.J13(VCC) U1#1.K8(VCC) U1#1.K13(VCC) U1#1.L8(VCC) U1#1.L13(VCC) U1#1.M8(VCC) U1#1.M13(VCC) U1#1.N8(VCC) U1#1.N9(VCC) U1#1.N10(VCC) U1#1.N11(VCC) U1#1.N12(VCC) U1#1.N13(VCC)
1.1V_A: C31.1 C32.1 C33.1 C34.1 C35.1 SJ1.2 U1#1.T6(VCCA0) U1#1.T15(VCCA1) U1#1.U6(VCCA0) U1#1.U15(VCCA1)
1.2VARX: FB3.2
1.2VATX: FB4.2
2.5V: C67.1 C68.1 C69.1 C70.1 C71.1 SJ4.2 U1#1.F6(VCCAUX) U1#1.F15(VCCAUX) U1#1.P6(VCCAUX) U1#1.P15(VCCAUX)
2.5V_A: C60.1 C61.1 C62.1 C63.1 C64.1 SJ3.2 U1#1.V10(VCCAUXA0) U1#1.V11(VCCAUXA0) U1#1.V17(VCCAUXA1) U1#1.V18(VCCAUXA1)
3.3V: C30.1 C36.1 C54.1 C65.1 C72.1 C94.1 D1#1.ANODE D2.ANODE P1.6 R3#1.1 R4#1.1 R5#1.1 R6#1.1 U1#1.P9(VCCIO8) U1#1.P10(VCCIO8) U3#1.8(VCC) U4.5(EN) U4.8(VIN) U5.5(EN) U5.8(VIN) U6.5(EN) U6.8(VIN) U7.5(EN) U7.8(VIN) U10.5(EN) U10.8(VIN)
GND: C30.2 C31.2 C32.2 C33.2 C34.2 C35.2 C36.2 C37.2 C38.2 C39.2 C40.2 C41.2 C42.2 C43.2 C44.2 C45.2 C47.2 C48.2 C49.2 C50.2 C51.2 C52.2 C53.2 C54.2 C55.2 C56.2 C57.2 C58.2 C59.2 C60.2 C61.2 C62.2 C63.2 C64.2 C65.2 C66.2 C67.2 C68.2 C69.2 C70.2 C71.2 C72.2 C73.2 C94.2 C95.2 C96.2 C97.2 C98.2 C99.2 C100.2 P1.1 R9#1.2 R10.2 R12.2 R14.2 R16.2 R18.2 R52.2 U1#1.B7(GND) U1#1.B14(GND) U1#1.C19(GND) U1#1.D4(GND) U1#1.F7(GND) U1#1.F8(GND) U1#1.F13(GND) U1#1.F14(GND) U1#1.G4(GND) U1#1.G6(GND) U1#1.G7(GND) U1#1.G8(GND) U1#1.G9(GND) U1#1.G10(GND) U1#1.G11(GND) U1#1.G12(GND) U1#1.G13(GND) U1#1.G14(GND) U1#1.G15(GND) U1#1.G17(GND) U1#1.H19(GND) U1#1.J2(GND) U1#1.J7(GND) U1#1.J9(GND) U1#1.J10(GND) U1#1.J11(GND) U1#1.J12(GND) U1#1.J14(GND) U1#1.K6(GND) U1#1.K7(GND) U1#1.K9(GND) U1#1.K10(GND) U1#1.K11(GND) U1#1.K12(GND) U1#1.K14(GND) U1#1.K15(GND) U1#1.L9(GND) U1#1.L10(GND) U1#1.L11(GND) U1#1.L12(GND) U1#1.M2(GND) U1#1.M7(GND) U1#1.M9(GND) U1#1.M10(GND) U1#1.M11(GND) U1#1.M12(GND) U1#1.M14(GND) U1#1.M16(GND) U1#1.N6(GND) U1#1.N7(GND) U1#1.N14(GND) U1#1.N15(GND) U1#1.P7(GND) U1#1.P8(GND) U1#1.P11(GND) U1#1.P12(GND) U1#1.P13(GND) U1#1.P14(GND) U1#1.R4(CFG_2) U1#1.R19(GND) U1#1.U4(CFG_0) U1#1.U7(GNDA) U1#1.U8(GNDA) U1#1.U9(GNDA) U1#1.U10(GNDA) U1#1.U11(GNDA) U1#1.U12(GNDA) U1#1.U13(GNDA) U1#1.U14(GNDA) U1#1.V5(GNDA) U1#1.V6(GNDA) U1#1.V7(GNDA) U1#1.V8(GNDA) U1#1.V9(GNDA) U1#1.V12(GNDA) U1#1.V13(GNDA) U1#1.V14(GNDA) U1#1.V15(GNDA) U1#1.V16(GNDA) U1#1.V19(GNDA) U1#1.V20(GNDA) U1#1.W6(GNDA) U1#1.W7(GNDA) U1#1.W12(GNDA) U1#1.W15(GNDA) U1#1.W16(GNDA) U1#1.W19(GNDA) U3#1.4(VSS) U4.4(GND) U4.9(GND) U5.4(GND) U5.9(GND) U6.4(GND) U6.9(GND) U7.4(GND) U7.9(GND) U10.4(GND) U10.9(GND)
CONF_DONE: R7#1.2 U1#1.Y3(DONE)
PROGRAMn: R4#1.2 U1#1.W3(PROGRAMN)
SPI_CLK: R10.1 U1#1.U3(CCLK/MCLK/SCK) U3#1.6(CLK)
SPI_CSn: R3#1.2 U1#1.R2(PB15A/HOLDN/DI/BUSY/CSSPIN/CEN) U3#1.1(~{CS})
SPI_IO2: U1#1.Y2(PB9B/D2/IO2) U3#1.3(~{WP}/IO2)
SPI_IO3: U1#1.W1(PB9A/D3/IO3) U3#1.7(~{HOLD}/IO3)
SPI_MISO: U1#1.V2(PB11A/D1/MISO/IO1) U3#1.2(DO/IO1)
SPI_MOSI: U1#1.W2(PB11B/D0/MOSI/IO0) U3#1.5(DI/IO0)
STATUS_LED: R8.2 U1#1.U2(PB13B/CS1N)
TCK: P1.4 R9#1.1 U1#1.T5(TCK/TEST_CLK) ; port TCK  [project net JTAG_TCK]
TDI: P1.2 U1#1.R5(TDI) ; port TDI  [project net JTAG_TDI]
TDO: P1.3 U1#1.V4(TDO) ; port TDO  [project net JTAG_TDO]
TMS: P1.5 U1#1.U5(TMS) ; port TMS  [project net JTAG_TMS]
NetC37_1: C37.1 R11.1 SJ1.1 U4.1(VOUT)
NetC55_1: C55.1 R13.1 SJ2.1 U5.1(VOUT)
NetC66_1: C66.1 R15.1 SJ3.1 U6.1(VOUT)
NetC73_1: C73.1 R17.1 SJ4.1 U7.1(VOUT)
NetC95_1: C95.1 R51.1 SJ6.1 U10.1(VOUT)
NetC96_1: C96.1 C97.1 C98.1 C99.1 C100.1 FB3.1 FB4.1 SJ6.2
NetD1#1_CATHODE: D1#1.CATHODE R7#1.1
NetD2_CATHODE: D2.CATHODE R8.1
NetR5#1_2: R5#1.2 U1#1.V3(INITN)
NetR6#1_2: R6#1.2 U1#1.T4(CFG_1)
NetR11_2: R11.2 R12.1 U4.3(FB)
NetR13_2: R13.2 R14.1 U5.3(FB)
NetR15_2: R15.2 R16.1 U6.3(FB)
NetR17_2: R17.2 R18.1 U7.3(FB)
NetR51_2: R51.2 R52.1 U10.3(FB)

Not connected (* = marked no-connect by the designer): U1#1 R1(PB4A/D7/IO7)* R3(PB15B/DOUT/CSON/ATB_FORCE)* T1(PB4B/D6/IO6)* T2(PB13A/SN/CSN/SCAN_SHFT_EN)* T3(PB18A/WRITEN/ATB_SENSE)* U1(PB6A/D5/MISO2/IO5)* V1(PB6B/D4/MOSI2/IO4)* W10(RESERVED)* W11(RESERVED)*; U4 2(NC) 6(NC) 7(NC); U5 2(NC) 6(NC) 7(NC); U6 2(NC) 6(NC) 7(NC); U7 2(NC) 6(NC) 7(NC); U10 2(NC) 6(NC) 7(NC)

### Notes on the sheet
- Copyright (c)
- Page Title
- Design Title
- Creative Commons License, http://creativecommons.org/licenses/by/4.0/legalcode
  This PCB design by Custom Embedded Solutions, LLC. is licensed under a Creative Commons Attribution 4.0 International License.
- Size:
- Date:
- File:
- C
- Document Number:
- Time:
- Sheet
- Rev:
- of

### Library data of the parts
C30 = 011-00017: CAP CER 1UF 6.3V 10% X5R 0402; Manufacturer1 Part Number: CL05A105KQ5NNNC; Manufacturer1: Samsung; Type: Ceramic; Types: Y1; Part Number: 011-00017; Voltage: 6.3V; Substrate: X5R; Value: 1uF; Package: 1005, EIA 0402, Chip Capacitor, 2-Leads, Body 1.00x0.50mm, IPC High Density
C31 C36 C37 C54-C60 C65-C67 C72 C73 C94-C96 = 011-00004: as C3#1 on sheet Lattice_ECP5; Part Number: 011-00004; Voltage: 6.3V; Substrate: X5R; Manufacturer2: Samsung; Manufacturer3: AVX; Value: 22uF; Package: 2012, EIA 0805, Chip Capacitor, 2-Leads, Body 2.00x1.25mm, IPC High Density
C32-C35 C38-C45 C47-C53 C61-C64 C68-C71 C97-C100 = 011-00017: as C1#1 on sheet Lattice_ECP5; Part Number: 011-00017; Substrate: X5R; Voltage: 6.3V; Value: 1uF; Package: 1005, EIA 0402, Chip Capacitor, 2-Leads, Body 1.00x0.50mm, IPC High Density
D1#1 D2 = 013-00003: LED Green SMD 20mA 2.2V 0603; Manufacturer1: Osram; Manufacturer1 Part Number: LG Q971-KN-1; Types: PNP; Preferred: Yes; Part Number: 013-00003; Current: 20mA; Voltage: 2.2V; Type: LED; Package: 0603, LED
FB3 FB4 = 010-00004: FERRITE CHIP 70 OHM 4000MA 0603; Manufacturer1: Samsung; Manufacturer1 Part Number: CIS10P700AC; Types: Signal Transformer; Current: 4A; DCR: 20mOhm; Preferred: Yes; Part Number: 010-00004; Type: Ferrite; Value: 70 Ohm; Package: 1608, EIA 0603, Chip Inductor, 2-Leads, Body 1.60x0.80mm, IPC High Density
P1 = 008-00006: Connector, plug of nails, 6pin, no legs; Package: Tag-Connect 6 position (NL)
R3#1 R4#1 R5#1 R6#1 R10 = 009-00001: as R1 on sheet Lattice_ECP5; Part Number: 009-00001; Power: 1/16W; Value: 4.75k; Package: 1005, EIA 0402, Chip Resistor, 2-Leads, Body 1.00x0.50mm, IPC High Density
R7#1 R8 = 009-00021: RES 120 OHM 1/16W 5% 0402; Manufacturer1 Part Number: RMCF0402JT120R; Manufacturer1: Stackpole Electronics; Tolerance: 0.05; Part Number: 009-00021; Power: 1/16W; Value: 120; Package: 1005, EIA 0402, Chip Resistor, 2-Leads, Body 1.00x0.50mm, IPC High Density
R9#1 = 009-00008: RES 1.10K OHM 1/16W 1% 0402 SMD; Manufacturer1 Part Number: RC0402FR-071K1L; Manufacturer1: Yageo; 3rd Party: {Reference Design}; Tolerance: 0.01; Part Number: 009-00008; Power: 1/16W; Value: 1.10k; Package: 1005, EIA 0402, Chip Resistor, 2-Leads, Body 1.00x0.50mm, IPC High Density
R11 R13 R15 R17 R51 = 009-00024: RES 24.9K OHM 1/10W 1% 0402 SMD; Manufacturer1 Part Number: ERJ-2RKF2492X; Manufacturer1: Panasonic; Tolerance: 0.01; Power: 1/16W; Part Number: 009-00024; Value: 24.9k; Package: 1005, EIA 0402, Chip Resistor, 2-Leads, Body 1.00x0.50mm, IPC High Density
R12 R14 = 009-00026: RES 66.5K OHM 1/10W 1% 0402 SMD; Manufacturer1 Part Number: ERJ-2RKF6652X; Manufacturer1: Panasonic; Tolerance: 0.01; Power: 1/16W; Part Number: 009-00026; Value: 66.5k; Package: 1005, EIA 0402, Chip Resistor, 2-Leads, Body 1.00x0.50mm, IPC High Density
R16 R18 = 009-00025: RES 11.8K OHM 1/10W 1% 0402 SMD; Manufacturer1 Part Number: ERJ-2RKF1182X; Manufacturer1: Panasonic; Tolerance: 0.01; Power: 1/16W; Part Number: 009-00025; Value: 11.8k; Package: 1005, EIA 0402, Chip Resistor, 2-Leads, Body 1.00x0.50mm, IPC High Density
R52 = 009-00031: RES 49.9K OHM 1/10W 1% 0402 SMD; Manufacturer1 Part Number: ERJ-2RKF4992X; Manufacturer1: Panasonic; Tolerance: 0.01; Power: 1/16W; Part Number: 009-00031; Value: 49.9k; Package: 1005, EIA 0402, Chip Resistor, 2-Leads, Body 1.00x0.50mm, IPC High Density
SJ1-SJ4 SJ6 = 008-00009: Solder Jumper, 50mil; Part Number: 008-00009; Package: Solder Jumper, 25x55mil
U1#1 = 012-00019: as U1#1 on sheet Lattice_ECP5; Part Number: 012-00019; Type: Embedded (uP/PLD); Package: CABGA 381 8x14x1.2mm 17.0x17.0mm 0.8mm pitch
U3#1 = 012-00017: IC FLASH 32MBIT 104MHZ 8SO; Manufacturer1 Part Number: S25FL032P0XMFI011; Manufacturer1: Spansion; Type: Memory; Package: SOIC, 8-Leads, Body 5.4x5.4mm
U4-U7 U10 = 012-00018: IC REG LDO ADJ 1A 8DFN; Manufacturer1: Diodes Inc; Preferred: Yes; Manufacturer1 Part Number: AP7361-FGE-7; Type: PMIC; Value: AP7361-FGE-7; Package: QFN, 8-Leads, Body 3.0x3.0mm (max), Pitch 0.65mm, IPC Medium Density

## Sheet MEC8_Expansion.SchDoc: <title>
size C; Organization: Custom Embedded Solutions, LLC.; Address1: 130 Oakland Trace; Address2: Madison, AL 35758; DocumentNumber: <doc_num>; Revision: <Rev>; SheetNumber: 7; SheetTotal: 8; PageTitle: MEC8 Expansion Interface
Used 2 times, as channels UA_Expansion, UB_Expansion. Parts and nets are listed once, with the designators drawn on the sheet.
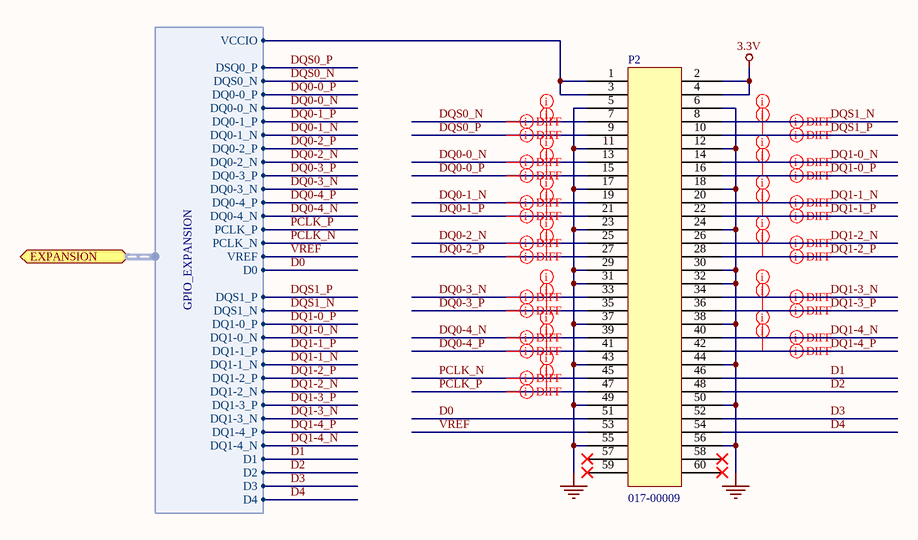
[diagram p3: MEC8_Expansion.SchDoc]

### Parts
P2  Part Number: 017-00009  [005-00021]  (no BOM)

### Ports
EXPANSION (harness GPIO_EXPANSION)

### Harnesses
GPIO_EXPANSION: DSQ0_P, DQS0_N, DQ0-0_P, DQ0-0_N, DQ0-1_P, DQ0-1_N, DQ0-2_P, DQ0-2_N, DQ0-3_P, DQ0-3_N, DQ0-4_P, DQ0-4_N, PCLK_P, PCLK_N, VREF, D0, DQS1_P, DQS1_N, DQ1-0_P, DQ1-0_N, DQ1-1_P, DQ1-1_N, DQ1-2_P, DQ1-2_N, DQ1-3_P, DQ1-3_N, DQ1-4_P, DQ1-4_N, D1, D2, D3, D4, VCCIO

### Nets
3.3V: P2.2 P2.4
GND: P2.5 P2.6 P2.11 P2.12 P2.17 P2.18 P2.23 P2.24 P2.29 P2.30 P2.31 P2.32 P2.37 P2.38 P2.43 P2.44 P2.49 P2.50 P2.55 P2.56
D0: P2.51 ; port EXPANSION.D0
D1: P2.46 ; port EXPANSION.D1
D2: P2.48 ; port EXPANSION.D2
D3: P2.52 ; port EXPANSION.D3
D4: P2.54 ; port EXPANSION.D4
DQ0-0_N: P2.13 ; port EXPANSION.DQ0-0_N
DQ0-0_P: P2.15 ; port EXPANSION.DQ0-0_P
DQ0-1_N: P2.19 ; port EXPANSION.DQ0-1_N
DQ0-1_P: P2.21 ; port EXPANSION.DQ0-1_P
DQ0-2_N: P2.25 ; port EXPANSION.DQ0-2_N
DQ0-2_P: P2.27 ; port EXPANSION.DQ0-2_P
DQ0-3_N: P2.33 ; port EXPANSION.DQ0-3_N
DQ0-3_P: P2.35 ; port EXPANSION.DQ0-3_P
DQ0-4_N: P2.39 ; port EXPANSION.DQ0-4_N
DQ0-4_P: P2.41 ; port EXPANSION.DQ0-4_P
DQ1-0_N: P2.14 ; port EXPANSION.DQ1-0_N
DQ1-0_P: P2.16 ; port EXPANSION.DQ1-0_P
DQ1-1_N: P2.20 ; port EXPANSION.DQ1-1_N
DQ1-1_P: P2.22 ; port EXPANSION.DQ1-1_P
DQ1-2_N: P2.26 ; port EXPANSION.DQ1-2_N
DQ1-2_P: P2.28 ; port EXPANSION.DQ1-2_P
DQ1-3_N: P2.34 ; port EXPANSION.DQ1-3_N
DQ1-3_P: P2.36 ; port EXPANSION.DQ1-3_P
DQ1-4_N: P2.40 ; port EXPANSION.DQ1-4_N
DQ1-4_P: P2.42 ; port EXPANSION.DQ1-4_P
DQS0_N: P2.7 ; port EXPANSION.DQS0_N
DQS0_P: P2.9 ; port EXPANSION.DSQ0_P
DQS1_N: P2.8 ; port EXPANSION.DQS1_N
DQS1_P: P2.10 ; port EXPANSION.DQS1_P
PCLK_N: P2.45 ; port EXPANSION.PCLK_N
PCLK_P: P2.47 ; port EXPANSION.PCLK_P
VREF: P2.53 ; port EXPANSION.VREF
NetP2_1: P2.1 P2.3 ; port EXPANSION.VCCIO

Not connected (* = marked no-connect by the designer): P2 57* 58* 59* 60*

### Channels
UA_Expansion: designators end in _UA_Expansion
UB_Expansion: designators end in _UB_Expansion

### Layout directives
differential pair: A_DQ0-0_N, A_DQ0-0_P, A_DQ0-1_N, A_DQ0-1_P, A_DQ0-2_N, A_DQ0-2_P, A_DQ0-3_N, A_DQ0-3_P, A_DQ0-4_N, A_DQ0-4_P, A_DQ1-0_N, A_DQ1-0_P, A_DQ1-1_N, A_DQ1-1_P, A_DQ1-2_N, A_DQ1-2_P, A_DQ1-3_N, A_DQ1-3_P, A_DQ1-4_N, A_DQ1-4_P, A_DQS0_N, A_DQS0_P, A_DQS1_N, A_DQS1_P, A_PCLK_N, A_PCLK_P
rule Matched Net Lengths [Tolerance = 25mil]; rule Differential Pairs Routing [Pref Gap = 0.125mm    Min Gap  = 0.125mm    Max Gap  = 1mmPref Width = 0.264mm    Min Width  = 0.095mm    Max Width  = 0.264mm]: A_DQ0-0_N, A_DQ0-0_P, A_DQ0-1_N, A_DQ0-1_P, A_DQ0-2_N, A_DQ0-2_P, A_DQ0-3_N, A_DQ0-3_P, A_DQ0-4_N, A_DQ0-4_P, A_DQ1-0_N, A_DQ1-0_P, A_DQ1-1_N, A_DQ1-1_P, A_DQ1-2_N, A_DQ1-2_P, A_DQ1-3_N, A_DQ1-3_P, A_DQ1-4_N, A_DQ1-4_P, A_DQS0_N, A_DQS0_P, A_DQS1_N, A_DQS1_P, A_PCLK_N, A_PCLK_P

### Notes on the sheet
- Copyright (c)
- Page Title
- Design Title
- Creative Commons License, http://creativecommons.org/licenses/by/4.0/legalcode
  This PCB design by Custom Embedded Solutions, LLC. is licensed under a Creative Commons Attribution 4.0 International License.
- Size:
- Date:
- File:
- C
- Document Number:
- Time:
- Sheet
- Rev:
- of

### Library data of the parts
P2 = 017-00009: CONN RCPT MEC8 60 POS; Manufacturer1 Part Number: MEC8-130-02-L-D-RA1; Manufacturer1: Samtec; Circuits: 60; Type: Receptacle; Package: MEC8, 0.8mm x 120 position

## Sheet PCIe_x1_edge.SchDoc: <title>
size C; CopyrightDate: 2014; Organization: Custom Embedded Solutions, LLC.; Address1: 130 Oakland Trace; Address2: Madison, AL 35758; DocumentNumber: <doc_num>; Revision: <Rev>; SheetNumber: 4; SheetTotal: 8; PageTitle: PCI Express x1 Edge Connector
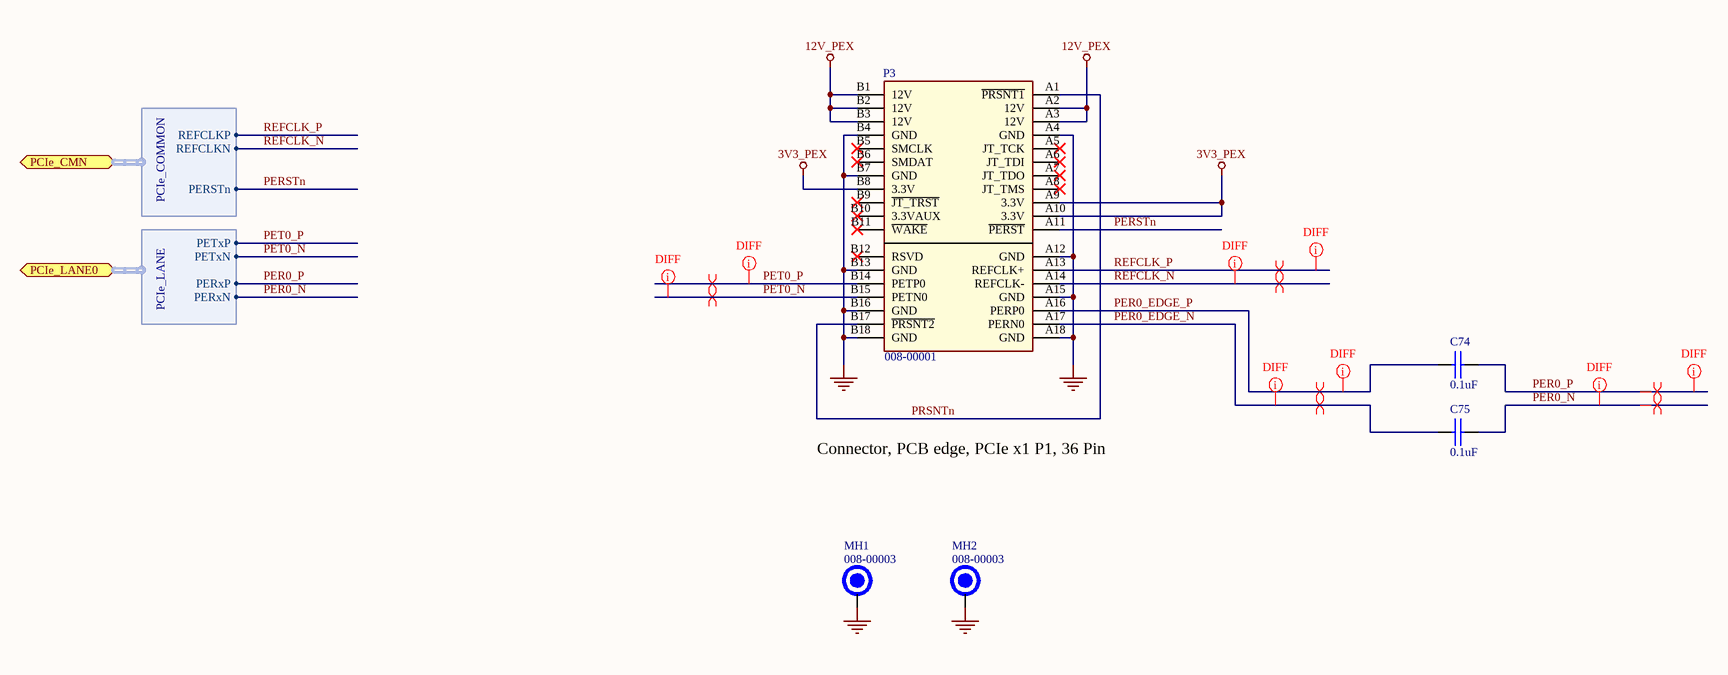
[diagram p4: PCIe_x1_edge.SchDoc]

### Parts
C74  0.1uF  [005-00008]
C75  0.1uF  [005-00008]
MH1  Part Number: 008-00003  [005-00019]  (hidden comment: 004-00017)  (no BOM)
MH2  Part Number: 008-00003  [005-00019]  (hidden comment: 004-00017)  (no BOM)
P3  Part Number: 008-00001  [005-00020]  (hidden comment: 004-00018)  (no BOM)

### Ports
PCIe_CMN (harness PCIe_COMMON), PCIe_LANE0 (harness PCIe_LANE)

### Harnesses
PCIe_COMMON: PERSTn, REFCLKP, REFCLKN
PCIe_LANE: PETxP, PETxN, PERxP, PERxN

### Nets
3V3_PEX: P3.A9(3.3V) P3.A10(3.3V) P3.B8(3.3V)
12V_PEX: P3.A2(12V) P3.A3(12V) P3.B1(12V) P3.B2(12V) P3.B3(12V)  [project net VIN]
GND: MH1.1 MH2.1 P3.A4(GND) P3.A12(GND) P3.A15(GND) P3.A18(GND) P3.B4(GND) P3.B7(GND) P3.B13(GND) P3.B16(GND) P3.B18(GND)
PER0_EDGE_N: C75.1 P3.A17(PERN0)
PER0_EDGE_P: C74.1 P3.A16(PERP0)
PER0_N: C75.2 ; port PCIe_LANE0.PERxN
PER0_P: C74.2 ; port PCIe_LANE0.PERxP
PERSTn: P3.A11(~{PERST}) ; port PCIe_CMN.PERSTn
PET0_N: P3.B15(PETN0) ; port PCIe_LANE0.PETxN
PET0_P: P3.B14(PETP0) ; port PCIe_LANE0.PETxP
PRSNTn: P3.A1(~{PRSNT1}) P3.B17(~{PRSNT2})
REFCLK_N: P3.A14(REFCLK-) ; port PCIe_CMN.REFCLKN
REFCLK_P: P3.A13(REFCLK+) ; port PCIe_CMN.REFCLKP

Not connected (* = marked no-connect by the designer): P3 A5(JT_TCK)* A6(JT_TDI)* A7(JT_TDO)* A8(JT_TMS)* B5(SMCLK)* B6(SMDAT)* B9(~{JT_TRST})* B10(3.3VAUX)* B11(~{WAKE})* B12(RSVD)*

### Layout directives
differential pair: PER0_EDGE_N, PER0_EDGE_P, PER0_N, PER0_P, PET0_N, PET0_P, REFCLK_N, REFCLK_P
rule Matched Net Lengths [Tolerance = 25mil]; rule Differential Pairs Routing [Pref Gap = 0.125mm    Min Gap  = 0.125mm    Max Gap  = 1mmPref Width = 0.264mm    Min Width  = 0.095mm    Max Width  = 0.264mm]: PER0_EDGE_N, PER0_EDGE_P, PER0_N, PER0_P, PET0_N, PET0_P, REFCLK_N, REFCLK_P

### Notes on the sheet
- Connector, PCB edge, PCIe x1 P1, 36 Pin
- Copyright (c)
- Page Title
- Design Title
- Creative Commons License, http://creativecommons.org/licenses/by/4.0/legalcode
  This PCB design by Custom Embedded Solutions, LLC. is licensed under a Creative Commons Attribution 4.0 International License.
- Size:
- Date:
- File:
- C
- Document Number:
- Time:
- Sheet
- Rev:
- of

### Library data of the parts
C74 C75 = 011-00011: Capacitor 0.1uF 16V 10% 0402 X7R; Manufacturer1 Part Number: C0402C104K4RACT; Manufacturer1: Kemet; 3rd Party: {Reference Design}; Type: Ceramic; Types: X1; Part Number: 011-00011; Voltage: 16V; Substrate: X7R; Value: 0.1uF; Package: 1005, EIA 0402, Chip Capacitor, 2-Leads, Body 1.00x0.50mm, IPC High Density
MH1 MH2 = 008-00003: PCB Mounting Hole, Round Pad, 250mil Diameter, 125mil Drill; Types: Fiducial; Package: PCB Mounting Hole, Round Pad, 250mil Diameter, 125mil Drill
P3 = 008-00001: Connector, PCB edge, PCIe x1 P1, 36 Pin; Types: Connector; Package: Edge Connector, PCI Express x1 (1mm, 36 position)

## Sheet MIC24085.SchDoc: <title>
size C; Organization: Custom Embedded Solutions, LLC.; Address1: 130 Oakland Trace; Address2: Madison, AL 35758; DocumentNumber: <doc_num>; Revision: <Rev>; SheetNumber: 8; SheetTotal: 8; PageTitle: 12V Buck Regulator
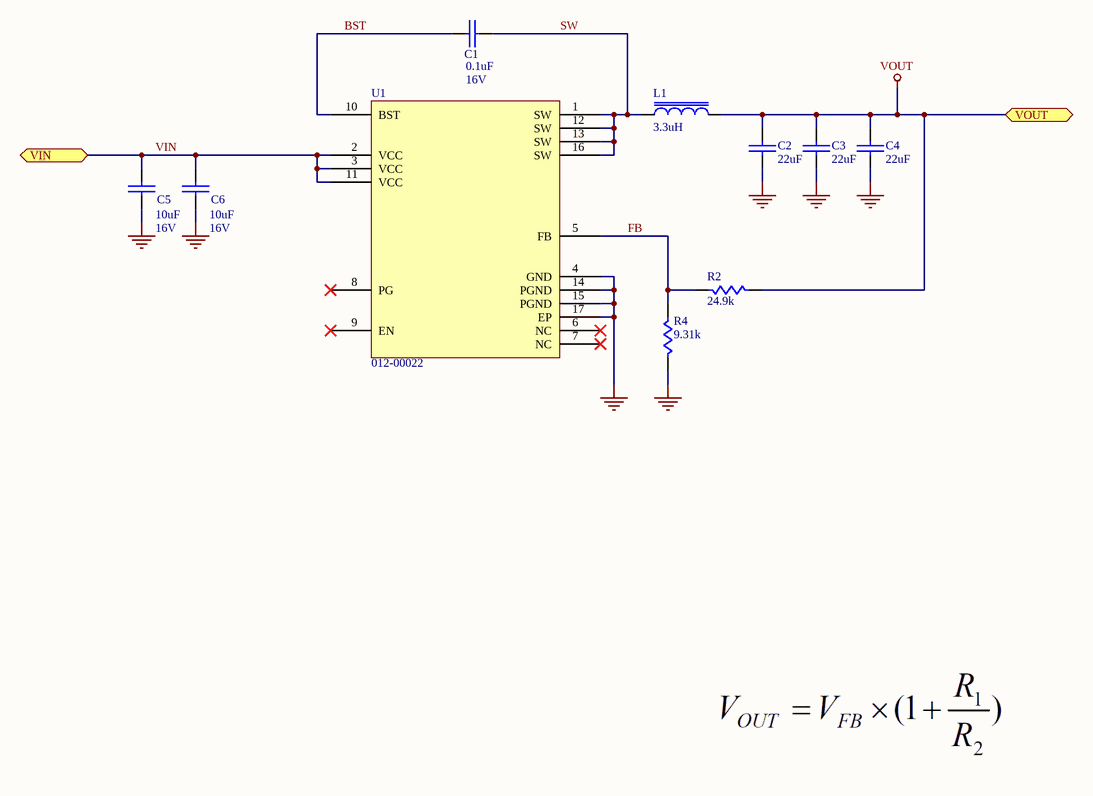
[diagram p5: MIC24085.SchDoc]

### Parts
(Parts that share a designator on the sheet are numbered #1, #2 ... from top to bottom, then left to right.)
C1#2  0.1uF  Voltage: 16V  [005-00008]
C2#2  22uF  [005-00003]
C3#2  22uF  [005-00003]
C4#2  22uF  [005-00003]
C5#2  10uF  Voltage: 16V  [005-00003]
C6#2  10uF  Voltage: 16V  [005-00003]
L1#1  3.3uH  [005-00012]
R2#2  24.9k  [005-00009]
R4#2  9.31k  [005-00009]
U1#2  Part Number: 012-00022  [005-00002]  (hidden comment: MIC24085)

### Ports
VIN, VOUT

### Nets
GND: C2#2.2 C3#2.2 C4#2.2 C5#2.2 C6#2.2 R4#2.2 U1#2.4(GND) U1#2.14(PGND) U1#2.15(PGND) U1#2.17(EP)
VIN: C5#2.1 C6#2.1 U1#2.2(VCC) U1#2.3(VCC) U1#2.11(VCC) ; port VIN
VOUT: C2#2.1 C3#2.1 C4#2.1 L1#1.2 R2#2.2 ; port VOUT  [project net 3.3V]
BST: C1#2.1 U1#2.10(BST)
FB: R2#2.1 R4#2.1 U1#2.5(FB)
SW: C1#2.2 L1#1.1 U1#2.1(SW) U1#2.12(SW) U1#2.13(SW) U1#2.16(SW)

Not connected (* = marked no-connect by the designer): U1#2 6(NC)* 7(NC)* 8(PG)* 9(EN)*

### Notes on the sheet
- Copyright (c)
- Page Title
- Design Title
- Creative Commons License, http://creativecommons.org/licenses/by/4.0/legalcode
  This PCB design by Custom Embedded Solutions, LLC. is licensed under a Creative Commons Attribution 4.0 International License.
- Size:
- Date:
- File:
- C
- Document Number:
- Time:
- Sheet
- Rev:
- of

### Library data of the parts
C1#2 = 011-00011: Capacitor 0.1uF 16V 10% 0402 X7R; 3rd Party: {Reference Design}; Manufacturer1: Kemet; Manufacturer1 Part Number: C0402C104K4RACT; Types: X1; Type: Ceramic; Part Number: 011-00011; Value: 0.1uF; Substrate: X7R; Package: 1005, EIA 0402, Chip Capacitor, 2-Leads, Body 1.00x0.50mm, IPC High Density
C2#2 C3#2 C4#2 = 011-00004: as C3#1 on sheet Lattice_ECP5; Part Number: 011-00004; Voltage: 6.3V; Substrate: X5R; Manufacturer2: Samsung; Manufacturer3: AVX; Value: 22uF; Package: 2012, EIA 0805, Chip Capacitor, 2-Leads, Body 2.00x1.25mm, IPC High Density
C5#2 C6#2 = 011-00020: CAP CER 10UF 16V 10% X5R 0805; Manufacturer1: Samsung; Manufacturer1 Part Number: CL21A106KOQNNNF; Type: Ceramic; Preferred: Yes; Part Number: 011-00020; Value: 10uF; Substrate: X5R; Package: 2012, EIA 0805, Chip Capacitor, 2-Leads, Body 2.00x1.25mm, IPC High Density; Life Cycle: Maturity
L1#1 = 010-00005: INDUCTOR POWER 3.3UH 3A NR5030; Manufacturer1: Taiyo Yuden; Manufacturer1 Part Number: NRS5030T3R3MMGJ; Types: Power Transformer; Type: Power Inductor; Tolerance: 0.2; Saturation Current: 3.6A; DCR: 30mOhm; Shielded: Yes; Part Number: 010-00005; Value: 3.3uH; Current: 3A; Package: NR5030, Taiyo Yuden 5mmx5mm; Preferred: Yes
R2#2 = 009-00024: as R11 on sheet Lattice_ECP5_power; Part Number: 009-00024; Value: 24.9k; Package: 1005, EIA 0402, Chip Resistor, 2-Leads, Body 1.00x0.50mm, IPC High Density
R4#2 = 009-00030: RES 9.31K OHM 1/10W 1% 0402 SMD; Manufacturer1 Part Number: ERJ-2RKF9311X; Manufacturer1: Panasonic; Tolerance: 0.01; Power: 1/16W; Part Number: 009-00030; Value: 9.31k; Package: 1005, EIA 0402, Chip Resistor, 2-Leads, Body 1.00x0.50mm, IPC High Density
U1#2 = 012-00022: IC REG BUCK SYNC ADJ 3A 16QFN; Manufacturer1: Micrel; Manufacturer1 Part Number: MIC24085AYML; Preferred: Yes; Type: PMIC; Value: MIC24085; Package: QFN, 16-Leads, Body 3.00x3.00mm, Pitch 0.50mm, Thermal Pad 1.70x1.70mm, IPC High Density; Life Cycle: Growth

## Sheet FT2232HQ_LATTICE_JTAG.SchDoc: <title>
size C; Organization: Custom Embedded Solutions, LLC.; Address1: 130 Oakland Trace; Address2: Madison, AL 35758; DocumentNumber: <doc_num>; Revision: <Rev>; SheetNumber: 6; SheetTotal: 8; PageTitle: USB JTAG Interface
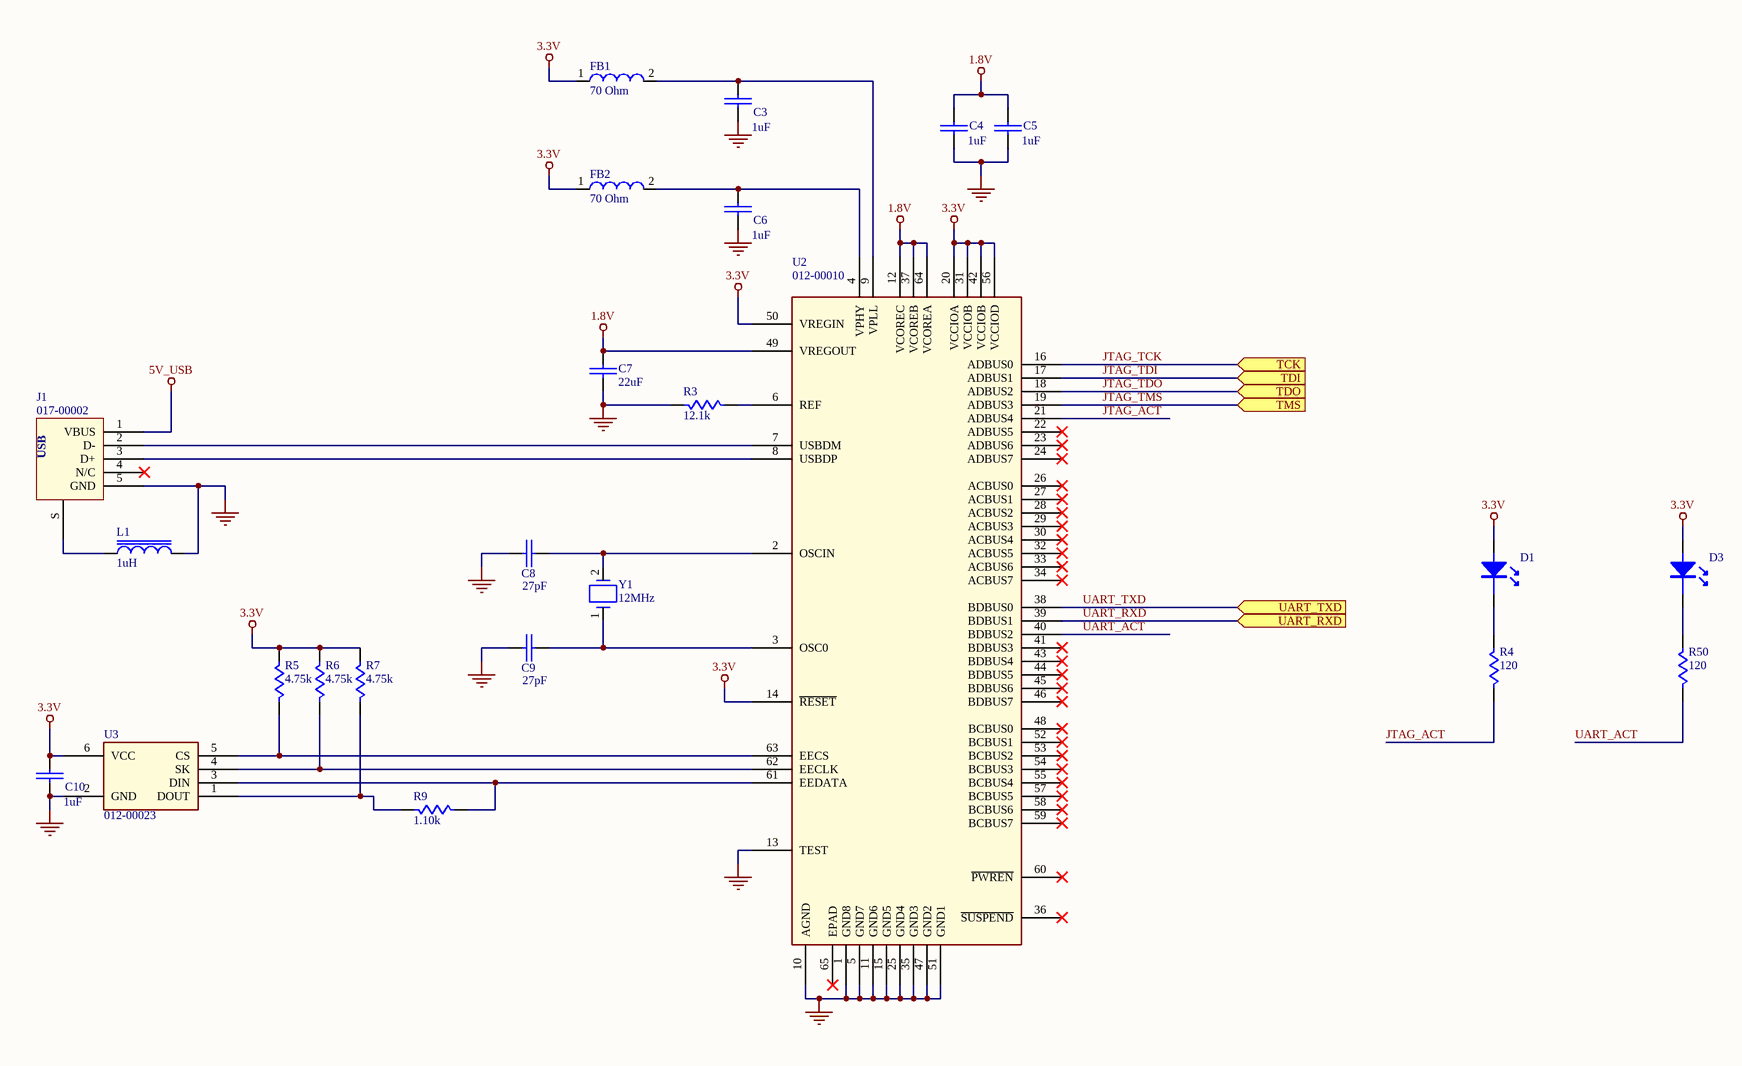
[diagram p6: FT2232HQ_LATTICE_JTAG.SchDoc]

### Parts
(Parts that share a designator on the sheet are numbered #1, #2 ... from top to bottom, then left to right.)
C3#3  1uF  [005-00008]
C4#3  1uF  [005-00008]
C5#3  1uF  [005-00008]
C6#3  1uF  [005-00008]
C7#2  22uF  [005-00003]
C8#2  27pF  [005-00008]
C9#2  27pF  [005-00008]
C10#2  1uF  [005-00008]
D1#2  (no value)  [005-00018]
D3  (no value)  [005-00018]
FB1  70 Ohm  [005-00010]
FB2  70 Ohm  [005-00010]
J1  Part Number: 017-00002  [005-00007]  (hidden comment: USB - Micro B)
L1#2  1uH  [005-00001]
R3#2  12.1k  [005-00009]
R4#3  120  [005-00009]
R5#2  4.75k  [005-00009]
R6#2  4.75k  [005-00009]
R7#2  4.75k  [005-00009]
R9#2  1.10k  [005-00009]
R50  120  [005-00009]
U2#2  Part Number: 012-00010  [005-00004]
U3#2  Part Number: 012-00023  [005-00006]  (hidden comment: 93LC56)
Y1  12MHz  [005-00005]

### Ports
TCK (in), TDI (in), TDO (in), TMS (in), UART_RXD (in), UART_TXD (in)

### Nets
1.8V: C4#3.1 C5#3.1 C7#2.1 U2#2.12(VCOREC) U2#2.37(VCOREB) U2#2.49(VREGOUT) U2#2.64(VCOREA)
3.3V: C10#2.1 D1#2.ANODE D3.ANODE FB1.1 FB2.1 R5#2.1 R6#2.1 R7#2.1 U2#2.14(~{RESET}) U2#2.20(VCCIOA) U2#2.31(VCCIOB) U2#2.42(VCCIOB) U2#2.50(VREGIN) U2#2.56(VCCIOD) U3#2.6(VCC)
5V_USB: J1.1(VBUS)
GND: C3#3.2 C4#3.2 C5#3.2 C6#3.2 C7#2.2 C8#2.1 C9#2.1 C10#2.2 J1.5(GND) L1#2.2 R3#2.1 U2#2.1(GND8) U2#2.5(GND7) U2#2.10(AGND) U2#2.11(GND6) U2#2.13(TEST) U2#2.15(GND5) U2#2.25(GND4) U2#2.35(GND3) U2#2.47(GND2) U2#2.51(GND1) U3#2.2(GND)
JTAG_ACT: R4#3.2 U2#2.21(ADBUS4)
JTAG_TCK: U2#2.16(ADBUS0) ; port TCK
JTAG_TDI: U2#2.17(ADBUS1) ; port TDI
JTAG_TDO: U2#2.18(ADBUS2) ; port TDO
JTAG_TMS: U2#2.19(ADBUS3) ; port TMS
UART_ACT: R50.2 U2#2.40(BDBUS2)
UART_RXD: U2#2.39(BDBUS1) ; port UART_RXD  [project net TOP18]
UART_TXD: U2#2.38(BDBUS0) ; port UART_TXD  [project net TOP8]
NetC3#3_1: C3#3.1 FB1.2 U2#2.9(VPLL)
NetC6#3_1: C6#3.1 FB2.2 U2#2.4(VPHY)
NetC8#2_2: C8#2.2 U2#2.2(OSCIN) Y1.2
NetC9#2_2: C9#2.2 U2#2.3(OSC0) Y1.1
NetD1#2_CATHODE: D1#2.CATHODE R4#3.1
NetD3_CATHODE: D3.CATHODE R50.1
NetJ1_2: J1.2(D-) U2#2.7(USBDM)
NetJ1_3: J1.3(D+) U2#2.8(USBDP)
NetJ1_S: J1.S L1#2.1
NetR3#2_2: R3#2.2 U2#2.6(REF)
NetR5#2_2: R5#2.2 U2#2.63(EECS) U3#2.5(CS)
NetR6#2_2: R6#2.2 U2#2.62(EECLK) U3#2.4(SK)
NetR7#2_2: R7#2.2 R9#2.1 U3#2.1(DOUT)
NetR9#2_2: R9#2.2 U2#2.61(EEDATA) U3#2.3(DIN)

Not connected (* = marked no-connect by the designer): J1 4(N/C)*; U2#2 22(ADBUS5)* 23(ADBUS6)* 24(ADBUS7)* 26(ACBUS0)* 27(ACBUS1)* 28(ACBUS2)* 29(ACBUS3)* 30(ACBUS4)* 32(ACBUS5)* 33(ACBUS6)* 34(ACBUS7)* 36(~{SUSPEND})* 41(BDBUS3)* 43(BDBUS4)* 44(BDBUS5)* 45(BDBUS6)* 46(BDBUS7)* 48(BCBUS0)* 52(BCBUS1)* 53(BCBUS2)* 54(BCBUS3)* 55(BCBUS4)* 57(BCBUS5)* 58(BCBUS6)* 59(BCBUS7)* 60(~{PWREN})* 65(EPAD)*

### Notes on the sheet
- Copyright (c)
- Page Title
- Design Title
- Creative Commons License, http://creativecommons.org/licenses/by/4.0/legalcode
  This PCB design by Custom Embedded Solutions, LLC. is licensed under a Creative Commons Attribution 4.0 International License.
- Size:
- Date:
- File:
- C
- Document Number:
- Time:
- Sheet
- Rev:
- of
- (in symbol 017-00002) USB

### Library data of the parts
C3#3 C4#3 C5#3 C6#3 C10#2 = 011-00010: Capacitor 1uF 10V Ceramic 10% 0402; 3rd Party: {Reference Design}; Manufacturer1: AVX; Manufacturer1 Part Number: 0402ZD105KAT2A; Types: Ratings; Part Number: 011-00010; Type: Ceramic; Value: 1uF; Voltage: 10V; Package: 1005, EIA 0402, Chip Capacitor, 2-Leads, Body 1.00x0.50mm, IPC High Density
C7#2 = 011-00004: CAP CER 22UF 6.3V X5R 20% 0805; Manufacturer1: TDK; Manufacturer1 Part Number: C2012X5R0J226M/1.25; 3rd Party: {Reference Design}; Manufacturer2 Part Number: CL21A226KQQNNNF; Manufacturer3 Part Number: 08056D226MAT2A; Type: Ceramic; Part Number: 011-00004; Value: 22uF; Voltage: 6.3V; Substrate: X5R; Package: 2012, EIA 0805, Chip Capacitor, 2-Leads, Body 2.00x1.25mm, IPC High Density; Manufacturer2: Samsung; Manufacturer3: AVX
C8#2 C9#2 = 011-00016: CAP CER 27PF 50V 5% C0G 0402; 3rd Party: {Reference Design}; Manufacturer1: Murata; Manufacturer1 Part Number: GRM1555C1H270JZ01D; Types: X2Y3; Type: Ceramic; Part Number: 011-00016; Value: 27pF; Voltage: 50V; Substrate: C0G; Package: 1005, EIA 0402, Chip Capacitor, 2-Leads, Body 1.00x0.50mm, IPC High Density
D1#2 D3 = 013-00003: as D1#1 on sheet Lattice_ECP5_power; Part Number: 013-00003; Type: LED; Current: 20mA; Voltage: 2.2V; Package: 0603, LED
FB1 FB2 = 010-00004: as FB3 on sheet Lattice_ECP5_power; Part Number: 010-00004; Type: Ferrite; Value: 70 Ohm; Package: 1608, EIA 0603, Chip Inductor, 2-Leads, Body 1.60x0.80mm, IPC High Density
J1 = 017-00002: CONN RECEPT USB 5POS RT ANG SMD; Manufacturer1: FCI; Manufacturer1 Part Number: 10118192-0001LF; Types: USB micro; Circuits: 5; Validation: Built; Preferred: Yes; Type: USB micro; Value: USB - Micro B; Package: Connector, USB, Micro B, Samtec
L1#2 = 010-00003: INDUCTOR POWER 1UH 2.2A 1008; Manufacturer1: Samsung; Manufacturer1 Part Number: CIG22E1R0MNE; Types: Signal Inductor; Type: Power Inductor; Tolerance: 0.2; Saturation Current: 2.3A; DCR: 48mOhm; Shielded: Yes; Validation: None; Part Number: 010-00003; Value: 1uH; Current: 2.2A; Package: 2520, EIA 1008, Chip Inductor, 2-Leads, Body 2.50x2.00mm, IPC High Density
R3#2 = 009-00002: RES 12.1K OHM 1/16W 1% 0402 SMD; 3rd Party: {Reference Design}; Manufacturer1: Yageo; Manufacturer1 Part Number: RC0402FR-0712K1L; Types: Thick Film; Tolerance: 0.01; Part Number: 009-00002; Value: 12.1k; Power: 1/16W; Package: 1005, EIA 0402, Chip Resistor, 2-Leads, Body 1.00x0.50mm, IPC High Density
R4#3 R50 = 009-00021: RES 120 OHM 1/16W 5% 0402; Manufacturer1: Stackpole Electronics; Manufacturer1 Part Number: RMCF0402JT120R; Tolerance: 0.05; Part Number: 009-00021; Value: 120; Power: 1/16W; Package: 1005, EIA 0402, Chip Resistor, 2-Leads, Body 1.00x0.50mm, IPC High Density
R5#2 R6#2 R7#2 = 009-00001: RES 4.75K OHM 1/16W 1% 0402 SMD; 3rd Party: {Reference Design}; Manufacturer1: Stackpole Electronics; Manufacturer1 Part Number: RMCF0402FT4K75; Types: Metal Film; Tolerance: 0.01; Part Number: 009-00001; Value: 4.75k; Power: 1/16W; Package: 1005, EIA 0402, Chip Resistor, 2-Leads, Body 1.00x0.50mm, IPC High Density
R9#2 = 009-00008: RES 1.10K OHM 1/16W 1% 0402 SMD; 3rd Party: {Reference Design}; Manufacturer1: Yageo; Manufacturer1 Part Number: RC0402FR-071K1L; Tolerance: 0.01; Part Number: 009-00008; Value: 1.10k; Power: 1/16W; Package: 1005, EIA 0402, Chip Resistor, 2-Leads, Body 1.00x0.50mm, IPC High Density
U2#2 = 012-00010: IC USB HS DUAL UART/FIFO 64-QFN; Manufacturer1: FTDI; Manufacturer1 Part Number: FT2232HQ; Type: Interface; Package: QFN, 64-Leads, Body 9.00x9.00mm, Pitch 0.50mm, Thermal Pad 4.35x4.35mm, IPC High Density
U3#2 = 012-00023: IC EEPROM 2KBIT 2MHZ SOT23-6; Manufacturer1: Microchip Technology; Manufacturer1 Part Number: 93LC56BT-I/OT; Type: Memory; Value: 93LC56; Package: SOT23, 6-Leads, Body 2.90x2.70mm, Pitch 0.95mm, IPC High Density
Y1 = 015-00006: CRYSTAL 12.000 MHZ 10PF SMD; Manufacturer1: TXC CORPORATION; Manufacturer1 Part Number: 7A-12.000MAAJ-T; Capacitance: 18pF; Stability: 30ppm; Preferred: Yes; Part Number: 015-00006; Value: 12MHz; Tolerance: 30ppm; Package: SMT, XTAL, 2-PAD 3.2mmx2.5mm